# EAGLE board gcl (EAGLE 8.0.0)
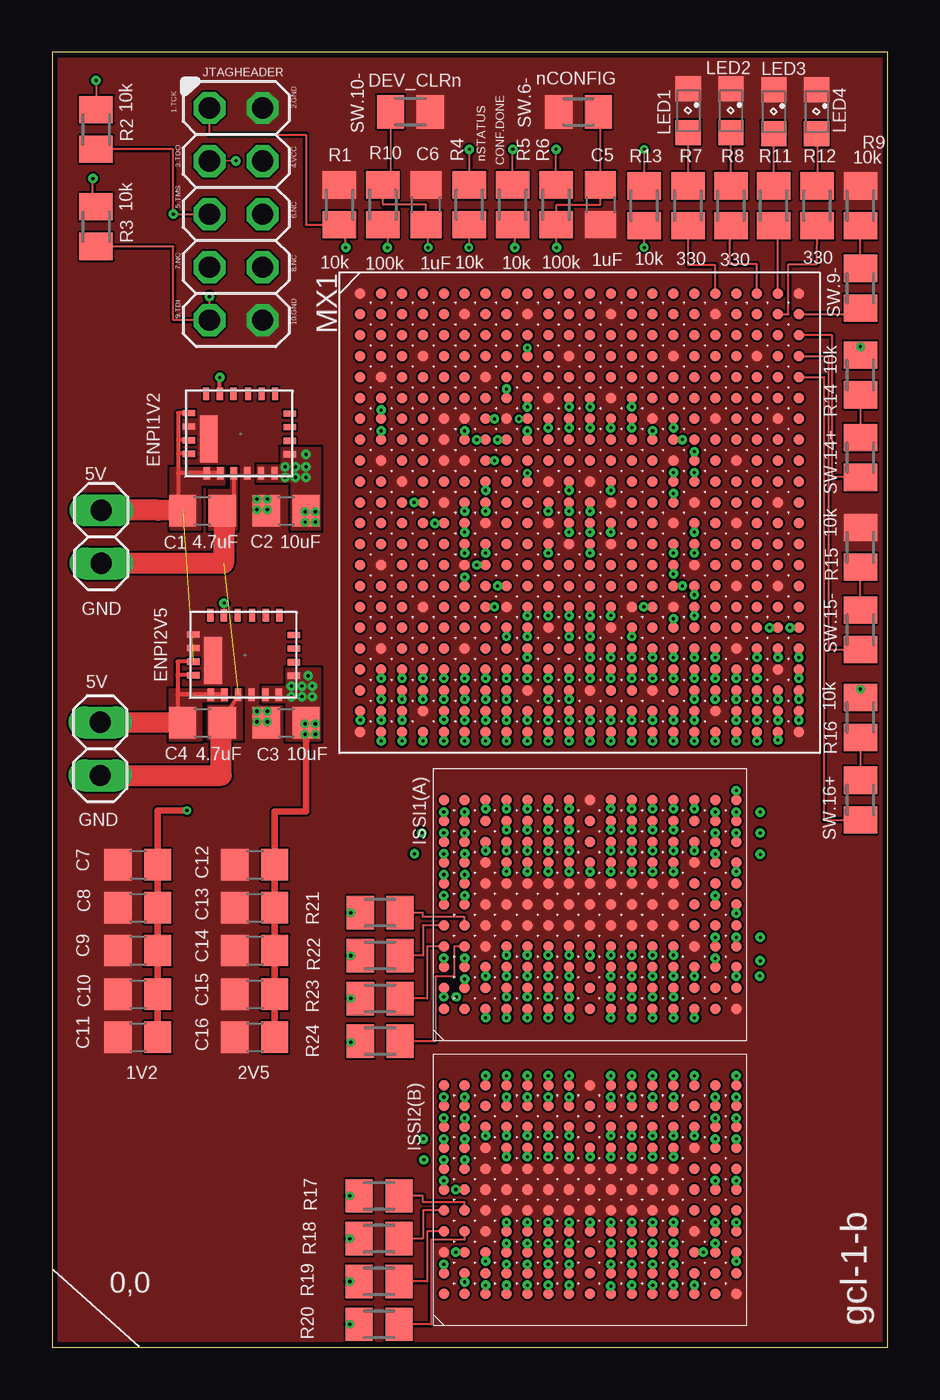
[diagram p5: board, top side]
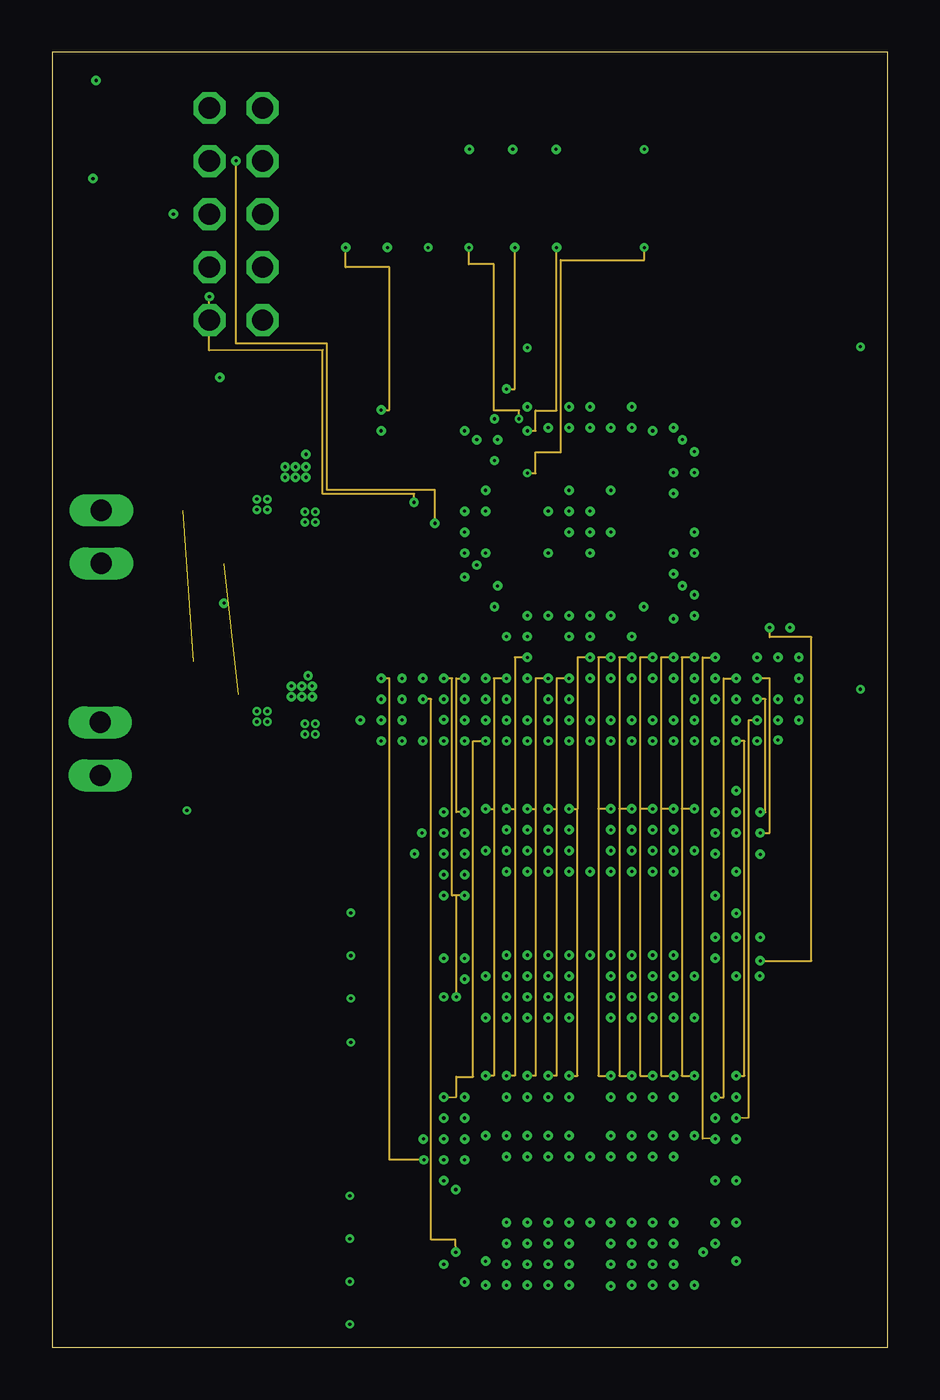
[diagram p6: board, inner layer Route2]
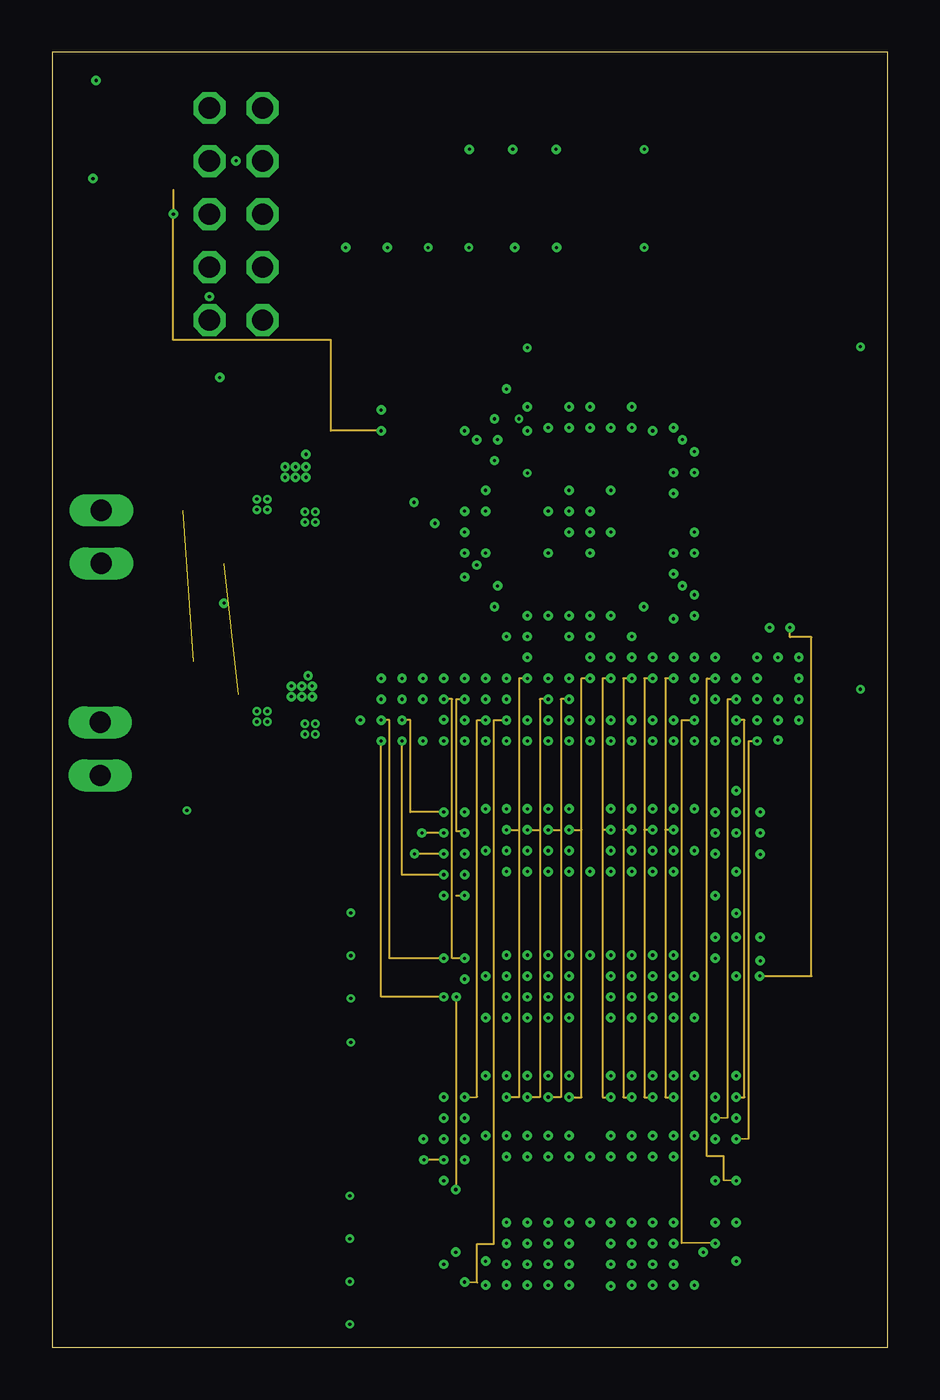
[diagram p7: board, inner layer Route3]
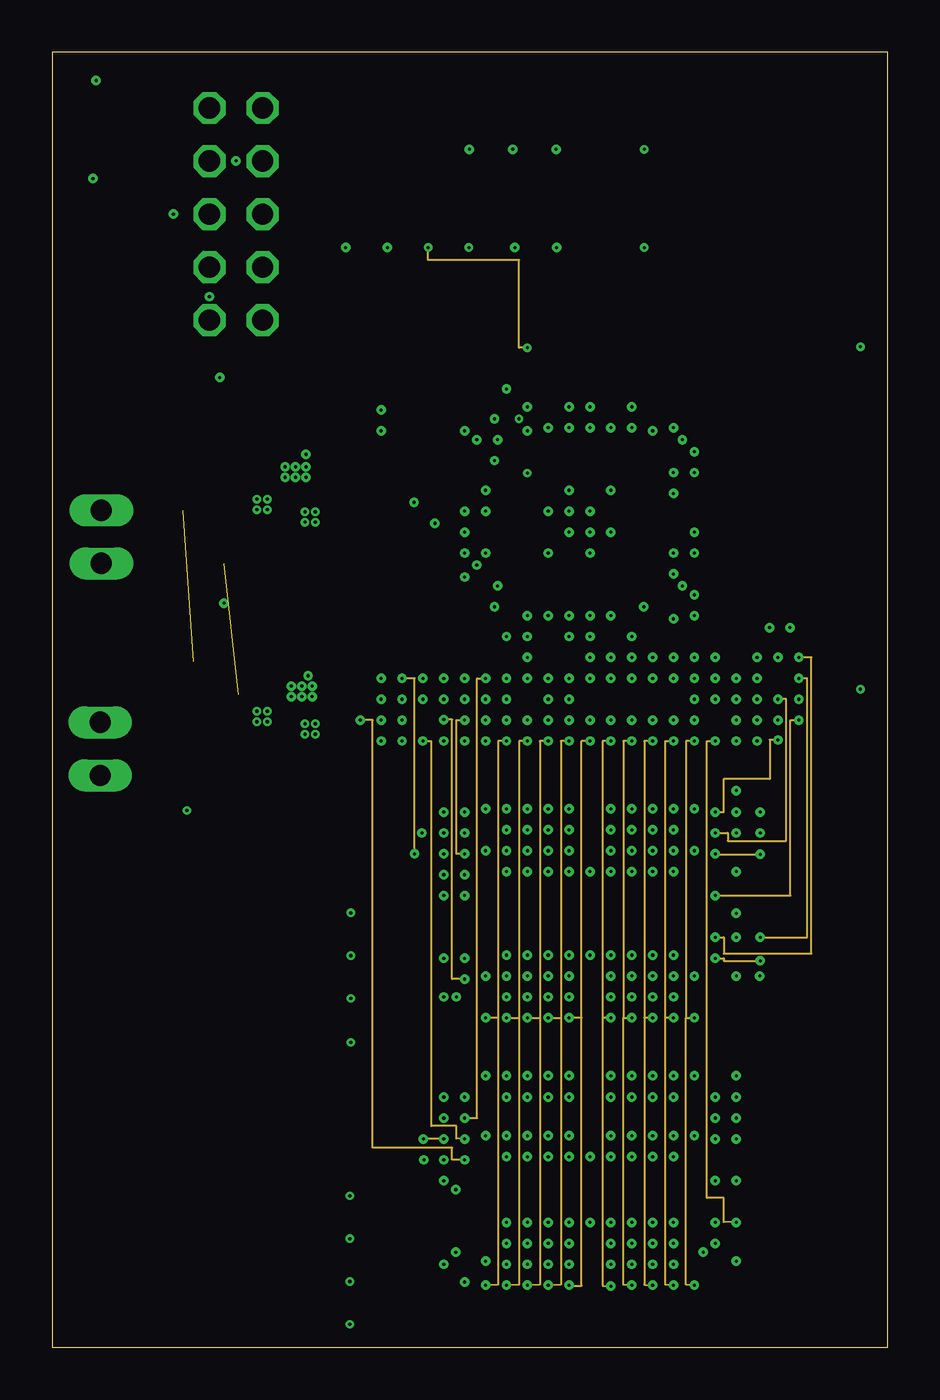
[diagram p8: board, inner layer Route14]
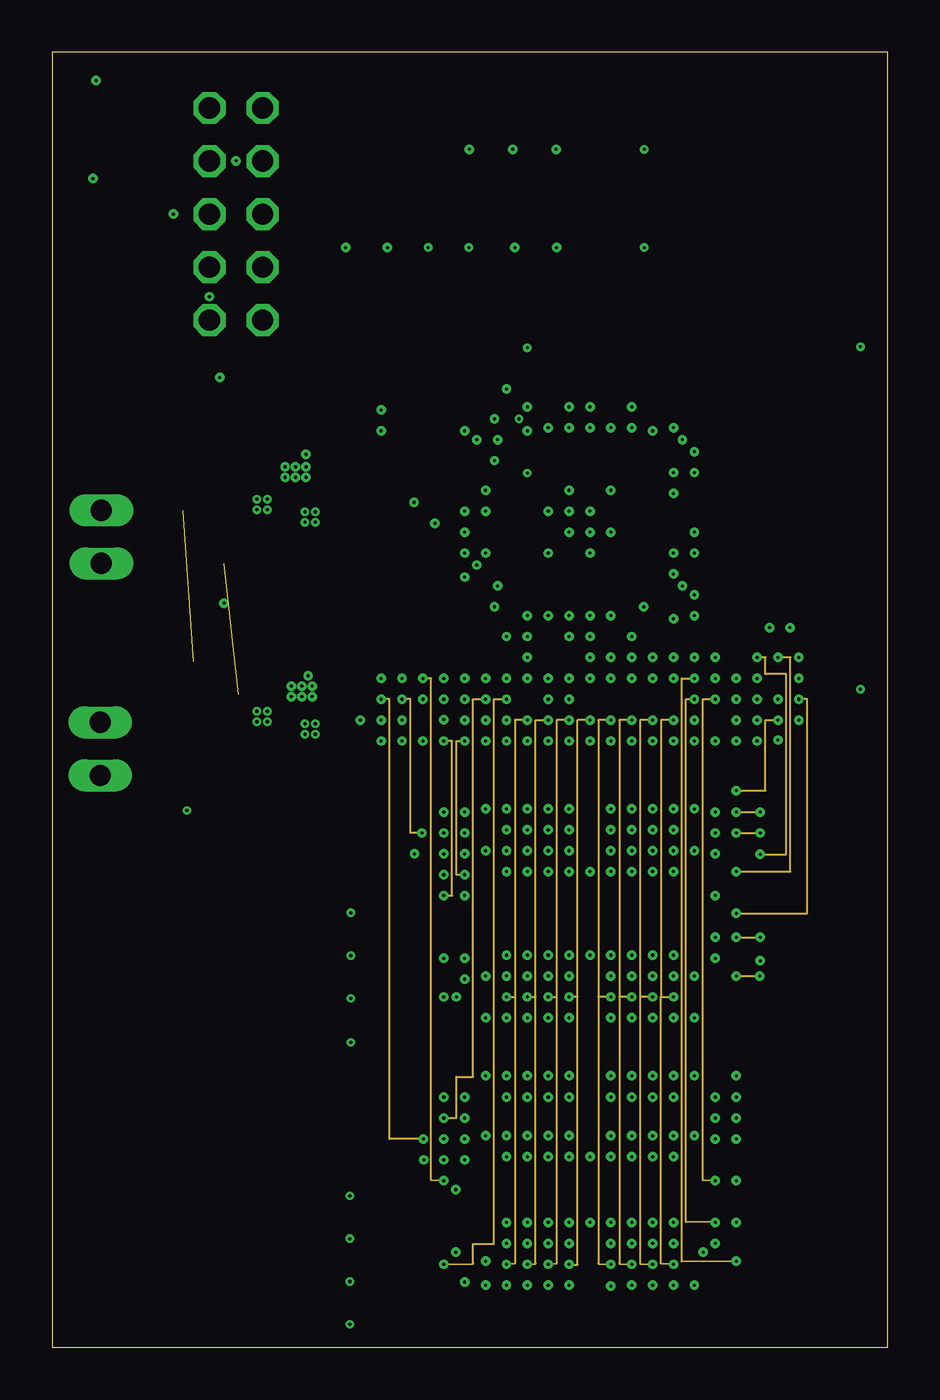
[diagram p9: board, inner layer Route15]
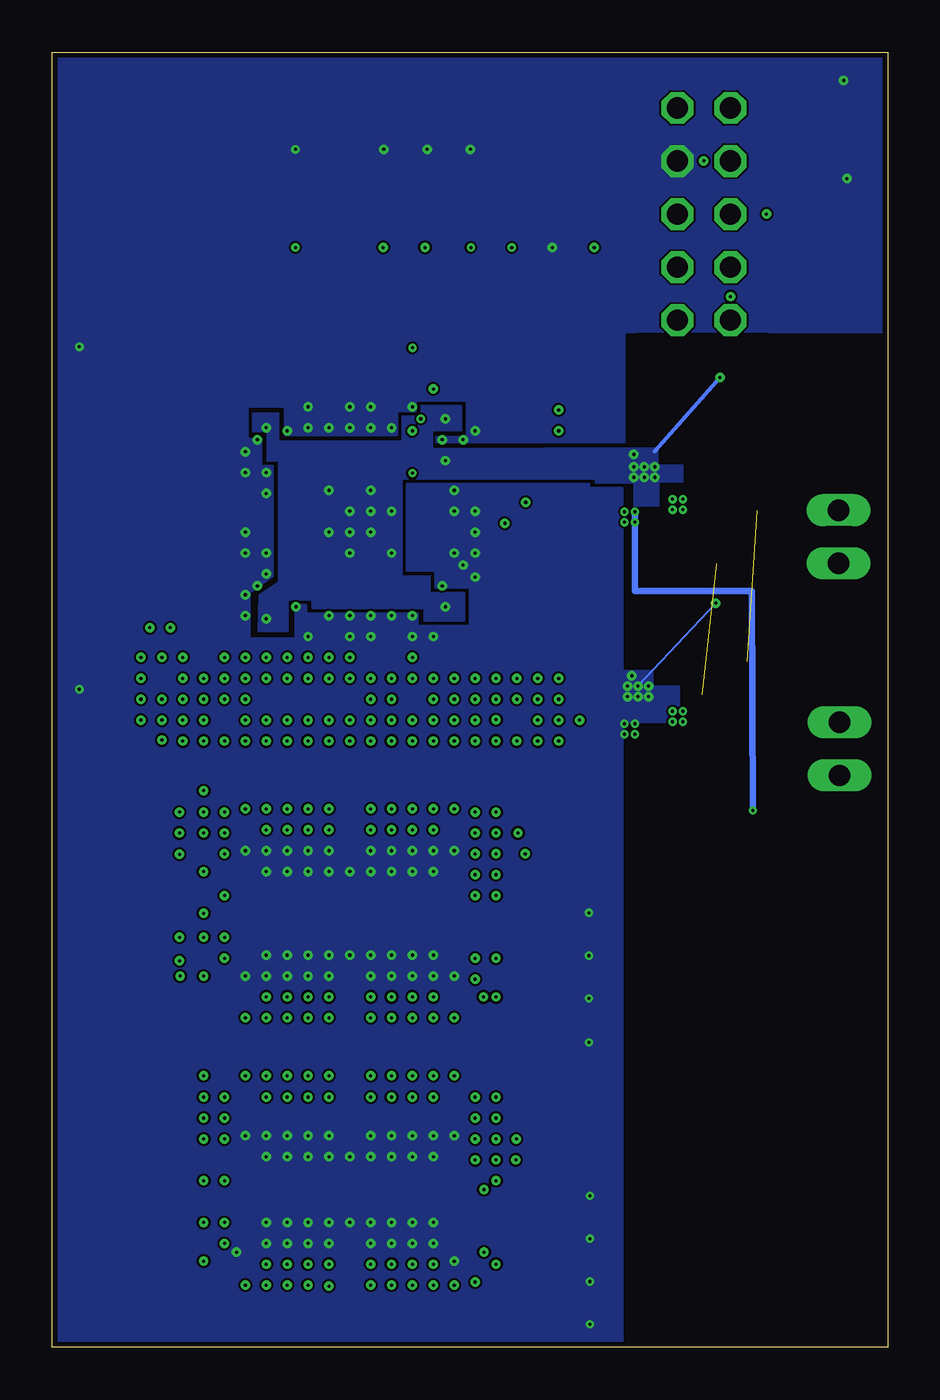
[diagram p10: board, bottom side, seen from below]

Size 40 x 62 mm. Coordinates in mm from the lower left corner, seen from the top.
Outline: 0,0 40,0 40,62 0,62 0,0
Copper layers (1+2*3+14*15+16): Top 0.012mm / dielectric 0.2mm / Route2 0.018mm / dielectric 0.36mm / Route3 0.018mm / dielectric 0.3mm / Route14 0.018mm / dielectric 0.36mm / Route15 0.018mm / dielectric 0.2mm / Bottom 0.012mm
Design rules "eC_6Layer_PClass8_BaseCopperO12-I18 *": minimum track width 0.1mm, minimum drill 0.15mm, track to track 0.1mm, track to pad 0.1mm, pad to pad 0.1mm, via to via 0.1mm, smd to smd 0mil, copper to edge 0.25mm, drill to drill 0.35mm, minimum pad ring 0.15mm, minimum via ring 0.1mm, stop-mask expansion 0mil, vias tented up to drill 0.1mm, thermal gap 0.2mm
Net classes: 1 sup: width 0.508 mm

## Footprints (pad centres in the part's own frame; a part is rotated, then mirrored left to right if it is on the bottom)
C0805 = smd 1.3 x 1.5: 1 -0.95,0; 2 0.95,0
EPAC = smd 0.3 x 0.6: 1@VIN 1.1,-4.05; 2@VIN 1.75,-4.05; 3@GND 2.4,-4.05; 4@GND 3.05,-4.05; 5@VOUT 3.7,-4.05; 6@VOUT 4.35,-4.05; 11@NC 4.375,-0.25; 12@NC 3.725,-0.25; 13@NC 3.075,-0.25; 14@NC 2.375,-0.25; 15@VSENSE 1.725,-0.25; 16@VFB 1.075,-0.25 | smd 0.6 x 0.3: 7@VOUT 5.075,-3.15; 8@NC 5.075,-2.5; 9@NC 5.075,-1.85; 10@NC 5.075,-1.2; 17@VS2 0.25,-1.175; 18@VS1 0.25,-1.825; 19@VS0 0.25,-2.475; 20@ENABLE 0.25,-3.125 | smd 0.9 x 2.25: 21@GND 1.2,-2.425
1X02 = drill 1.016 long: 1 -1.27,0; 2 1.27,0
ISSI = smd 0.5 x 0.5: A1@NC 1.55,14.55; A2@A7 2.55,14.55; A3@CEB 3.55,14.55; A4@BWCB 4.55,14.55; A5@BWBB 5.55,14.55; A6@CE2B 6.55,14.55; A7@CKEB 7.55,14.55; A8@ADV 8.55,14.55; A9@A9 9.55,14.55; A10@A11 10.55,14.55; A11@NC 11.55,14.55; B1@NC 1.55,13.55; B2@A6 2.55,13.55; B3@CE2 3.55,13.55; B4@BWDB 4.55,13.55; B5@BWAB 5.55,13.55; B6@CLK 6.55,13.55; B7@WEB 7.55,13.55; B8@OEB 8.55,13.55; B9@A8 9.55,13.55; B10@A10 10.55,13.55; B11@NC 11.55,13.55; C1@DQC0 1.55,12.55; C2@NC 2.55,12.55; C3@VDDQ 3.55,12.55; C4@GND 4.55,12.55; C5@GND 5.55,12.55; C6@GND 6.55,12.55; C7@GND 7.55,12.55; C8@GND 8.55,12.55; C9@VDDQ 9.55,12.55; C10@NC 10.55,12.55; C11@DQB0 11.55,12.55; D1@DQC1 1.55,11.55; D2@DQC3 2.55,11.55; D3@VDDQ 3.55,11.55; D4@VDD 4.55,11.55; D5@GND 5.55,11.55; D6@GND 6.55,11.55; D7@GND 7.55,11.55; D8@VDD 8.55,11.55; D9@VDDQ 9.55,11.55; D10@DQB1 10.55,11.55; D11@DQB4 11.55,11.55; E1@DQC2 1.55,10.55; E2@DQC4 2.55,10.55; E3@VDDQ 3.55,10.55; E4@VDD 4.55,10.55; E5@GND 5.55,10.55; E6@GND 6.55,10.55; E7@GND 7.55,10.55; E8@VDD 8.55,10.55; E9@VDDQ 9.55,10.55; E10@DQB2 10.55,10.55; E11@DQB5 11.55,10.55; F1@DQC5 1.55,9.55; F2@DQC7 2.55,9.55; F3@VDDQ 3.55,9.55; F4@VDD 4.55,9.55; F5@GND 5.55,9.55; F6@GND 6.55,9.55; F7@GND 7.55,9.55; F8@VDD 8.55,9.55; F9@VDDQ 9.55,9.55; F10@DQB3 10.55,9.55; F11@DQB7 11.55,9.55; G1@DQC6 1.55,8.55; G2@DQC8 2.55,8.55; G3@VDDQ 3.55,8.55; G4@VDD 4.55,8.55; G5@GND 5.55,8.55; G6@GND 6.55,8.55; G7@GND 7.55,8.55; G8@VDD 8.55,8.55; G9@VDDQ 9.55,8.55; G10@DQB6 10.55,8.55; G11@DQB8 11.55,8.55; H1@NC 1.55,7.55; H2@NC 2.55,7.55; H3@NC 3.55,7.55; H4@VDD 4.55,7.55; H5@GND 5.55,7.55; H6@GND 6.55,7.55; H7@GND 7.55,7.55; H8@VDD 8.55,7.55; H9@NC 9.55,7.55; H10@NC 10.55,7.55; H11@ZZ 11.55,7.55; J1@DQD8 1.55,6.55; J2@DQD6 2.55,6.55; J3@VDDQ 3.55,6.55; J4@VDD 4.55,6.55; J5@GND 5.55,6.55; J6@GND 6.55,6.55; J7@GND 7.55,6.55; J8@VDD 8.55,6.55; J9@VDDQ 9.55,6.55; J10@DQA8 10.55,6.55; J11@DQA6 11.55,6.55; K1@DQD7 1.55,5.55; K2@DQD3 2.55,5.55; K3@VDDQ 3.55,5.55; K4@VDD 4.55,5.55; K5@GND 5.55,5.55; K6@GND 6.55,5.55; K7@GND 7.55,5.55; K8@VDD 8.55,5.55; K9@VDDQ 9.55,5.55; K10@DQA7 10.55,5.55; K11@DQA5 11.55,5.55; L1@DQD5 1.55,4.55; L2@DQD2 2.55,4.55; L3@VDDQ 3.55,4.55; L4@VDD 4.55,4.55; L5@GND 5.55,4.55; L6@GND 6.55,4.55; L7@GND 7.55,4.55; L8@VDD 8.55,4.55; L9@VDDQ 9.55,4.55; L10@DQA4 10.55,4.55; L11@DQA2 11.55,4.55; M1@DQD4 1.55,3.55; M2@DQD1 2.55,3.55; M3@VDDQ 3.55,3.55; M4@VDD 4.55,3.55; M5@GND 5.55,3.55; M6@GND 6.55,3.55; M7@GND 7.55,3.55; M8@VDD 8.55,3.55; M9@VDDQ 9.55,3.55; M10@DQA3 10.55,3.55; M11@DQA1 11.55,3.55; N1@DQD0 1.55,2.55; N2@NC 2.55,2.55; N3@VDDQ 3.55,2.55; N4@GND 4.55,2.55; N5@NC 5.55,2.55; N6@NC 6.55,2.55; N7@NC 7.55,2.55; N8@GND 8.55,2.55; N9@VDDQ 9.55,2.55; N10@NC 10.55,2.55; N11@DQA0 11.55,2.55; P1@NC 1.55,1.55; P2@NC 2.55,1.55; P3@A5 3.55,1.55; P4@A2 4.55,1.55; P5@TDI 5.55,1.55; P6@A1 6.55,1.55; P7@TDO 7.55,1.55; P8@A18 8.55,1.55; P9@A15 9.55,1.55; P10@A14 10.55,1.55; P11@NC 11.55,1.55; R1@MODE 1.55,0.55; R2@NC 2.55,0.55; R3@A4 3.55,0.55; R4@A3 4.55,0.55; R5@TMS 5.55,0.55; R6@A0 6.55,0.55; R7@TCK 7.55,0.55; R8@A17 8.55,0.55; R9@A16 9.55,0.55; R10@A13 10.55,0.55; R11@A12 11.55,0.55
2X05 = drill 1.016 octagon: 1 -5.08,-1.27; 2 -5.08,1.27; 3 -2.54,-1.27; 4 -2.54,1.27; 5 0,-1.27; 6 0,1.27; 7 2.54,-1.27; 8 2.54,1.27; 9 5.08,-1.27; 10 5.08,1.27
SML0805 = smd 1.2 x 1.2: A 1.05,0; C -1.05,0
MXPAC = smd 0.5 x 0.5: A1@GND 2,-2; A2@IO325 3,-2; A3@IO326 4,-2; A4@IO327 5,-2; A5@IO328 6,-2; A6@IO329 7,-2; A7@IO284 8,-2; A8@IO285 9,-2; A9@IO286 10,-2; A10@IO273 11,-2; A11@IO274 12,-2; A12@IO275 13,-2; A13@IO276 14,-2; A14@IO277 15,-2; A15@IO278 16,-2; A16@IO279 17,-2; A17@IO280 18,-2; A18@IO281 19,-2; A19@IO282 20,-2; A20@IO283 21,-2; A21@IO213 22,-2; A22@GND 23,-2; AA1@IO77 2,-22; AA2@IO79 3,-22; AA3@IO80 4,-22; AA4@GND 5,-22; AA5@IO81 6,-22; AA6@IO82 7,-22; AA7@IO83 8,-22; AA8@IO84 9,-22; AA9@IO85 10,-22; AA10@IO78 11,-22; AA11@IO125 12,-22; AA12@IO126 13,-22; AA13@IO127 14,-22; AA14@IO128 15,-22; AA15@IO129 16,-22; AA16@IO130 17,-22; AA17@IO131 18,-22; AA18@GND 19,-22; AA19@IO132 20,-22; AA20@IO133 21,-22; AA21@IO173 22,-22; AA22@IO174 23,-22; AB1@GND 2,-23; AB2@IO86 3,-23; AB3@IO87 4,-23; AB4@IO88 5,-23; AB5@IO89 6,-23; AB6@IO90 7,-23; AB7@IO91 8,-23; AB8@IO92 9,-23; AB9@IO93 10,-23; AB10@IO134 11,-23; AB11@IO135 12,-23; AB12@IO136 13,-23; AB13@IO137 14,-23; AB14@IO138 15,-23; AB15@IO139 16,-23; AB16@IO140 17,-23; AB17@IO141 18,-23; AB18@IO142 19,-23; AB19@IO143 20,-23; AB20@IO144 21,-23; AB21@IO145 22,-23; AB22@GND 23,-23; B1@IO330 2,-3; B2@IO331 3,-3; B3@IO332 4,-3; B4@IO333 5,-3; B5@IO334 6,-3; B6@GND 7,-3; B7@IO335 8,-3; B8@IO295 9,-3; B9@GND 10,-3; B10@IO287 11,-3; B11@IO288 12,-3; B12@IO289 13,-3; B13@GND 14,-3; B14@IO290 15,-3; B15@IO291 16,-3; B16@IO292 17,-3; B17@IO293 18,-3; B18@GND 19,-3; B19@IO294 20,-3; B20@IO214 21,-3; B21@IO215 22,-3; B22@IO216 23,-3; C1@IO17 2,-4; C2@IO336 3,-4; C3@IO337 4,-4; C4@IO338 5,-4; C5@IO339 6,-4; C6@IO340 7,-4; C7@IO341 8,-4; C8@IO342 9,-4; C9@IO306 10,-4; C10@IO296 11,-4; C11@IO297 12,-4; C12@IO298 13,-4; C13@IO299 14,-4; C14@IO300 15,-4; C15@IO301 16,-4; C16@IO302 17,-4; C17@IO303 18,-4; C18@IO304 19,-4; C19@IO305 20,-4; C20@IO217 21,-4; C21@IO218 22,-4; C22@IO219 23,-4; D1@IO18 2,-5; D2@IO19 3,-5; D3@IO20 4,-5; D4@GND 5,-5; D5@IO344 6,-5; D6@IO345 7,-5; D7@IO346 8,-5; D8@IO347 9,-5; D9@IO348 10,-5; D10@IO343 11,-5; D11@GND 12,-5; D12@IO307 13,-5; D13@IO308 14,-5; D14@IO309 15,-5; D15@IO310 16,-5; D16@GND 17,-5; D17@IO311 18,-5; D18@IO220 19,-5; D19@IO221 20,-5; D20@GND 21,-5; D21@IO222 22,-5; D22@IO223 23,-5; E1@IO21 2,-6; E2@GND 3,-6; E3@IO1 4,-6; E4@IO2 5,-6; E5@NC 6,-6; E6@IO351 7,-6; E7@GND 8,-6; E8@IO352 9,-6; E9@IO353 10,-6; E10@IO349 11,-6; E11@IO350 12,-6; E12@IO312 13,-6; E13@IO313 14,-6; E14@IO314 15,-6; E15@IO315 16,-6; E16@IO316 17,-6; E17@IO224 18,-6; E18@IO225 19,-6; E19@IO226 20,-6; E20@IO227 21,-6; E21@IO228 22,-6; E22@IO229 23,-6; F1@IO22 2,-7; F2@IO23 3,-7; F3@IO3 4,-7; F4@IO4 5,-7; F5@IO5 6,-7; F6@NC 7,-7; F7@IO354 8,-7; F8@IO355 9,-7; F9@VCCIO8 10,-7; F10@GND 11,-7; F11@VCCIO8 12,-7; F12@VCCIO7 13,-7; F13@GND 14,-7; F14@VCCIO7 15,-7; F15@IO317 16,-7; F16@IO318 17,-7; F17@IO230 18,-7; F18@IO231 19,-7; F19@IO232 20,-7; F20@IO233 21,-7; F21@IO234 22,-7; F22@IO235 23,-7; G1@IO24 2,-8; G2@IO25 3,-8; G3@IO6 4,-8; G4@IO7 5,-8; G5@GND 6,-8; G6@GND 7,-8; G7@VCCD_PLL3 8,-8; G8@GND 9,-8; G9@IO356 10,-8; G10@VCCIO8 11,-8; G11@VCCIO8 12,-8; G12@VCCIO7 13,-8; G13@VCCIO7 14,-8; G14@VCCIO7 15,-8; G15@GND 16,-8; G16@VCCD_PLL2 17,-8; G17@IO236 18,-8; G18@GND 19,-8; G19@IO237 20,-8; G20@IO238 21,-8; G21@GND 22,-8; G22@IO239 23,-8; H1@IO26 2,-9; H2@IO27 3,-9; H3@IO8 4,-9; H4@IO9 5,-9; H5@GND 6,-9; H6@VCCA3 7,-9; H7@VCCA3 8,-9; H8@VCCA3 9,-9; H9@IO359 10,-9; H10@IO357 11,-9; H11@IO358 12,-9; H12@IO319 13,-9; H13@IO320 14,-9; H14@IO321 15,-9; H15@VCCA2 16,-9; H16@VCCIO6 17,-9; H17@IO240 18,-9; H18@IO241 19,-9; H19@IO242 20,-9; H20@IO243 21,-9; H21@IO244 22,-9; H22@IO245 23,-9; J1@IO28 2,-10; J2@GND 3,-10; J3@IO10 4,-10; J4@IO11 5,-10; J5@GND 6,-10; J6@GND 7,-10; J7@VCC 8,-10; J8@IO12 9,-10; J9@IO13 10,-10; J10@IO360 11,-10; J11@IO322 12,-10; J12@IO323 13,-10; J13@IO324 14,-10; J14@IO246 15,-10; J15@IO247 16,-10; J16@GND 17,-10; J17@VCCIO6 18,-10; J18@IO248 19,-10; J19@GND 20,-10; J20@IO249 21,-10; J21@IO250 22,-10; J22@IO251 23,-10; K1@IO29 2,-11; K2@IO30 3,-11; K3@GND 4,-11; K4@IO14 5,-11; K5@IO15 6,-11; K6@IO16 7,-11; K7@VCCIO1A 8,-11; K8@IO31 9,-11; K9@IO32 10,-11; K10@GND 11,-11; K11@VCC 12,-11; K12@GND 13,-11; K13@VCC 14,-11; K14@IO252 15,-11; K15@IO253 16,-11; K16@VCCIO6 17,-11; K17@VCCIO6 18,-11; K18@IO254 19,-11; K19@IO255 20,-11; K20@IO256 21,-11; K21@IO257 22,-11; K22@IO258 23,-11; L1@IO33 2,-12; L2@IO34 3,-12; L3@DNU 4,-12; L4@IO35 5,-12; L5@GND 6,-12; L6@VCCIO1A 7,-12; L7@VCCIO1B 8,-12; L8@IO36 9,-12; L9@IO37 10,-12; L10@VCC 11,-12; L11@VCC 12,-12; L12@VCC 13,-12; L13@GND 14,-12; L14@IO259 15,-12; L15@IO260 16,-12; L16@VCCIO6 17,-12; L17@GND 18,-12; L18@IO261 19,-12; L19@IO262 20,-12; L20@IO263 21,-12; L21@GND 22,-12; L22@IO175 23,-12; M1@IO41 2,-13; M2@IO42 3,-13; M3@IO38 4,-13; M4@IO39 5,-13; M5@IO40 6,-13; M6@VCCIO1B 7,-13; M7@GND 8,-13; M8@IO43 9,-13; M9@IO44 10,-13; M10@GND 11,-13; M11@VCC 12,-13; M12@VCC 13,-13; M13@VCC 14,-13; M14@IO264 15,-13; M15@IO265 16,-13; M16@GND 17,-13; M17@VCCIO6 18,-13; M18@IO266 19,-13; M19@GND 20,-13; M20@IO267 21,-13; M21@IO176 22,-13; M22@IO177 23,-13; N1@IO45 2,-14; N2@IO46 3,-14; N3@IO47 4,-14; N4@IO48 5,-14; N5@IO49 6,-14; N6@VCCIO2 7,-14; N7@VCCIO2 8,-14; N8@IO50 9,-14; N9@IO51 10,-14; N10@VCC 11,-14; N11@GND 12,-14; N12@VCC 13,-14; N13@GND 14,-14; N14@IO268 15,-14; N15@IO269 16,-14; N16@VCCIO5 17,-14; N17@VCCIO6 18,-14; N18@IO270 19,-14; N19@IO271 20,-14; N20@IO272 21,-14; N21@IO178 22,-14; N22@IO179 23,-14; P1@IO52 2,-15; P2@GND 3,-15; P3@IO53 4,-15; P4@IO54 5,-15; P5@IO55 6,-15; P6@GND 7,-15; P7@VCCIO2 8,-15; P8@IO56 9,-15; P9@IO96 10,-15; P10@IO94 11,-15; P11@IO95 12,-15; P12@IO146 13,-15; P13@IO147 14,-15; P14@IO180 15,-15; P15@IO181 16,-15; P16@VCCIO5 17,-15; P17@GND 18,-15; P18@IO182 19,-15; P19@IO183 20,-15; P20@IO184 21,-15; P21@IO185 22,-15; P22@IO186 23,-15; R1@IO57 2,-16; R2@IO58 3,-16; R3@IO59 4,-16; R4@IO60 5,-16; R5@IO61 6,-16; R6@VCCIO2 7,-16; R7@IO62 8,-16; R8@VCCA1 9,-16; R9@IO99 10,-16; R10@IO97 11,-16; R11@IO98 12,-16; R12@IO148 13,-16; R13@IO149 14,-16; R14@IO187 15,-16; R15@IO188 16,-16; R16@VCCIO5 17,-16; R17@VCCIO5 18,-16; R18@IO189 19,-16; R19@GND 20,-16; R20@IO190 21,-16; R21@GND 22,-16; R22@IO191 23,-16; T1@IO63 2,-17; T2@IO64 3,-17; T3@IO65 4,-17; T4@GND 5,-17; T5@IO66 6,-17; T6@IO67 7,-17; T7@VCCD_PLL1 8,-17; T8@GND 9,-17; T9@VCCIO3 10,-17; T10@VCCIO3 11,-17; T11@VCCIO3 12,-17; T12@VCCIO4 13,-17; T13@VCCIO4 14,-17; T14@GND 15,-17; T15@VCCA4 16,-17; T16@GND 17,-17; T17@VCCIO5 18,-17; T18@IO192 19,-17; T19@IO193 20,-17; T20@IO194 21,-17; T21@IO195 22,-17; T22@IO196 23,-17; U1@IO68 2,-18; U2@IO69 3,-18; U3@IO70 4,-18; U4@IO71 5,-18; U5@IO72 6,-18; U6@IO100 7,-18; U7@IO101 8,-18; U8@VCCIO3 9,-18; U9@VCCIO3 10,-18; U10@GND 11,-18; U11@VCCIO4 12,-18; U12@VCCIO4 13,-18; U13@GND 14,-18; U14@VCCIO4 15,-18; U15@IO150 16,-18; U16@VCCD_PLL4 17,-18; U17@IO197 18,-18; U18@IO198 19,-18; U19@IO199 20,-18; U20@IO200 21,-18; U21@IO201 22,-18; U22@IO202 23,-18; V1@IO73 2,-19; V2@GND 3,-19; V3@IO74 4,-19; V4@IO103 5,-19; V5@IO104 6,-19; V6@GND 7,-19; V7@IO105 8,-19; V8@IO106 9,-19; V9@IO107 10,-19; V10@IO102 11,-19; V11@IO151 12,-19; V12@IO152 13,-19; V13@IO153 14,-19; V14@IO154 15,-19; V15@IO155 16,-19; V16@IO156 17,-19; V17@IO157 18,-19; V18@IO203 19,-19; V19@GND 20,-19; V20@IO204 21,-19; V21@IO205 22,-19; V22@IO206 23,-19; W1@IO75 2,-20; W2@IO76 3,-20; W3@IO109 4,-20; W4@IO110 5,-20; W5@IO111 6,-20; W6@IO112 7,-20; W7@IO113 8,-20; W8@IO114 9,-20; W9@IO115 10,-20; W10@IO108 11,-20; W11@IO158 12,-20; W12@IO159 13,-20; W13@IO160 14,-20; W14@IO161 15,-20; W15@IO162 16,-20; W16@IO163 17,-20; W17@IO164 18,-20; W18@IO165 19,-20; W19@IO207 20,-20; W20@IO208 21,-20; W21@GND 22,-20; W22@IO209 23,-20; Y1@IO116 2,-21; Y2@IO118 3,-21; Y3@IO119 4,-21; Y4@IO120 5,-21; Y5@IO121 6,-21; Y6@IO122 7,-21; Y7@IO123 8,-21; Y8@IO124 9,-21; Y9@GND 10,-21; Y10@IO117 11,-21; Y11@IO166 12,-21; Y12@GND 13,-21; Y13@IO167 14,-21; Y14@IO168 15,-21; Y15@GND 16,-21; Y16@IO169 17,-21; Y17@IO170 18,-21; Y18@IO171 19,-21; Y19@IO172 20,-21; Y20@IO210 21,-21; Y21@IO211 22,-21; Y22@IO212 23,-21
M0805 = smd 1.3 x 1.6: 1 -0.95,0; 2 0.95,0

## Placement (x,y rotation side)
C1  [C0805]  7.2,40.05 0 top
C2  [C0805]  11.2,40.05 0 top
C3  [C0805]  11.2,29.9 0 top
C4  [C0805]  7.2,29.9 0 top
C5  1uF  [C0805]  26.25,54.7 270 top
C6  1uF  [C0805]  17.9,54.7 90 top
C7  [C0805]  4.1,23.1 0 top
C8  [C0805]  4.1,21.05 0 top
C9  [C0805]  4.1,19 0 top
C10  [C0805]  4.1,16.9 0 top
C11  [C0805]  4.1,14.85 0 top
C12  [C0805]  9.7,23.1 0 top
C13  [C0805]  9.7,21.05 0 top
C14  [C0805]  9.7,19 0 top
C15  [C0805]  9.7,16.9 0 top
C16  [C0805]  9.7,14.85 0 top
ENPI1V2  ENPIRIONEVAR1  [EPAC]  6.3,45.9 0 top
ENPI2V5  ENPIRIONEVAR1  [EPAC]  6.5,35.3 0 top
INPOW  [1X02]  2.35,38.8 270 top
INPOW2  [1X02]  2.3,28.65 270 top
ISSI1(A)  [ISSI]  33.3,14.65 90 top
ISSI2(B)  [ISSI]  33.3,1 90 top
JTAGHEADER  [2X05]  8.8,54.25 270 top
LED1  [SML0805]  30.45,59.2 270 top
LED2  [SML0805]  32.5,59.2 270 top
LED3  [SML0805]  34.55,59.15 270 top
LED4  [SML0805]  36.6,59.15 270 top
MX1  [MXPAC]  12.75,52.45 0 top
R1  10k  [M0805]  13.75,54.7 90 top
R2  10k  [M0805]  2.1,58.3 90 top
R3  10k  [M0805]  2.1,53.65 90 top
R4  10k  [M0805]  19.97,54.7 270 top
R5  10k  [M0805]  22.05,54.7 270 top
R6  100k  [M0805]  24.12,54.7 270 top
R7  330  [M0805]  30.45,54.65 270 top
R8  330  [M0805]  32.5,54.65 270 top
R9  10k  [M0805]  38.7,54.65 270 top
R10  100k  [M0805]  15.82,54.7 90 top
R11  330  [M0805]  34.55,54.65 270 top
R12  330  [M0805]  36.62,54.65 270 top
R13  10k  [M0805]  28.35,54.65 270 top
R14  10k  [M0805]  38.7,46.55 270 top
R15  10k  [M0805]  38.7,38.3 270 top
R16  10k  [M0805]  38.7,30.15 270 top
R17  10k  [M0805]  15.65,7.25 0 top
R18  10k  [M0805]  15.65,5.2 0 top
R19  10k  [M0805]  15.65,3.15 0 top
R20  10k  [M0805]  15.65,1.1 0 top
R21  10k  [M0805]  15.7,20.8 0 top
R22  10k  [M0805]  15.7,18.75 0 top
R23  10k  [M0805]  15.7,16.7 0 top
R24  10k  [M0805]  15.7,14.65 0 top
SW.6-  0  [M0805]  25.2,59.15 180 top
SW.9-  0  [M0805]  38.7,50.7 270 top
SW.10-  0  [M0805]  17.15,59.15 0 top
SW.14+  0  [M0805]  38.7,42.6 270 top
SW.15-  0  [M0805]  38.7,34.35 270 top
SW.16+  0  [M0805]  38.7,26.2 270 top

## Tracks (layer width: path | path; a pad name or v marks a point on that pad's centre or on a via)
1V2  (via drill 0.15 pad 0.4, 0.15 pad 0.45)
  Top 0.1: MX1.L11@VCC v24.75,40.02 | MX1.L10@VCC v23.75,40.02 | MX1.M11@VCC v24.75,39.02 | MX1.M12@VCC v25.75,39.02 | MX1.N12@VCC v25.75,38.02 | MX1.N10@VCC v23.75,38.02 | MX1.M13@VCC v26.75,39.02 | MX1.L12@VCC v25.75,40.02 | MX1.K11@VCC v24.75,41.02 | MX1.K13@VCC v26.75,41.02 | MX1.G16@VCCD_PLL2 v29.75,44.02 | MX1.U16@VCCD_PLL4 v29.75,34.88 | MX1.G7@VCCD_PLL3 v21.18,44.45 | MX1.T7@VCCD_PLL1 v21.18,35.45 | MX1.J7@VCC v21.18,42.45
  Top 0.2: ENPI1V2.15@VSENSE v8.02,46.42
  Top 0.305: C11.2 C10.2 C9.2 C8.2 C7.2 5.05,25.7 v6.45,25.7
  Bottom 0.1: v24.75,40.02 24.7,40 | v23.75,40.02 23.75,39.95 | v25.75,38.02 25.75,37.95 | v23.75,38.02 23.75,37.95 | v26.75,39.02 26.75,38.95 | v25.75,40.02 25.75,39.95 | v24.75,41.02 24.75,40.95 | v26.75,41.02 26.75,40.95 | v29.75,44.02 29.75,43.95 | v29.75,34.88 29.75,34.95 | v21.18,42.45 21.25,42.45
  Bottom 0.2: v8.02,46.42 11.15,42.9
  Bottom 0.305: v6.45,25.7 6.5,36.2 12.1,36.2 v12.1,40
  other vias: 12.15,42.15 12.15,42.75 12.15,41.65 11.65,42.15 11.65,41.65 11.15,41.65 11.15,42.15 12.6,40 12.1,39.5 12.6,39.5
  pour Bottom (no thermals): 11,43.05 21.8,43 21.8,43.9 20.4,43.9 20.4,45.05 22.35,45.05 22.35,44.55 23.25,44.55 23.25,43.35 29.15,43.35 29.15,44.7 30.4,44.7 30.4,43.85 29.7,43.85 29.7,42.45 29.15,42.45 29.15,36.6 30.1,36 30.15,34.3 28.7,34.3 28.7,35.8 27.55,35.8 27.55,35.4 22.2,35.4 22.2,34.8 20.25,34.8 20.25,36.1 21.9,36.1 21.9,36.9 23.25,36.9 23.25,41.6 14,41.6 14,41.4 12.15,41.4 12.15,40.3 10.95,40.3 10.95,41.45 9.8,41.45 9.8,42.2 11,42.2
  pour Top (no thermals): 12.85,39.15 12.85,43.05 10.95,43.05 10.95,42.2 9.8,42.2 9.8,41.45 11.45,41.45 11.45,39.15
2V5  (via drill 0.15 pad 0.4, 0.15 pad 0.45)
  Top 0.1: MX1.F9@VCCIO8 v22.75,45.02 | MX1.G10@VCCIO8 v23.75,44.02 | MX1.G11@VCCIO8 v24.75,44.02 | MX1.F11@VCCIO8 v24.75,45.02 | MX1.F12@VCCIO7 v25.75,45.02 | MX1.G12@VCCIO7 v25.75,44.02 | MX1.G13@VCCIO7 v26.75,44.02 | MX1.G14@VCCIO7 v27.75,44.02 | MX1.F14@VCCIO7 v27.75,45.02 | MX1.H15@VCCA2 v28.75,43.88 | MX1.H16@VCCIO6 v30.18,43.45 | MX1.K16@VCCIO6 v29.75,41.88 | MX1.K17@VCCIO6 v30.75,41.88 | MX1.J17@VCCIO6 v30.75,42.88 | MX1.M17@VCCIO6 v30.75,39.02 | MX1.N17@VCCIO6 v30.75,38.02 | MX1.N16@VCCIO5 v29.75,38.02 | MX1.L16@VCCIO6 v29.75,40.88 | MX1.P16@VCCIO5 v29.75,37.02 | MX1.R16@VCCIO5 v30.18,36.45 | MX1.R17@VCCIO5 v30.75,36.02 | MX1.T17@VCCIO5 v30.75,35.02 | MX1.T15@VCCA4 v28.32,35.45 | MX1.U14@VCCIO4 v27.75,34.02 | MX1.T13@VCCIO4 v26.75,35.02 | MX1.T12@VCCIO4 v25.75,35.02 | MX1.U12@VCCIO4 v25.75,34.02 | MX1.U11@VCCIO4 v24.75,34.02 | MX1.T11@VCCIO3 v24.75,35.02 | MX1.T10@VCCIO3 v23.75,35.02 | MX1.T9@VCCIO3 v22.75,35.02 | MX1.U9@VCCIO3 v22.75,34.02 | MX1.U8@VCCIO3 v21.75,34.02 | MX1.R8@VCCA1 v21.32,36.45 | MX1.R6@VCCIO2 v19.75,36.88 | MX1.P7@VCCIO2 v20.32,37.45 | MX1.N7@VCCIO2 v20.75,38.02 | MX1.N6@VCCIO2 v19.75,38.02 | MX1.M6@VCCIO1B v19.75,39.02 | MX1.L6@VCCIO1A v19.75,40.02 | MX1.L7@VCCIO1B v20.75,40.02 | MX1.K7@VCCIO1A v20.75,41.02 | MX1.H6@VCCA3 v19.75,43.88 | MX1.H7@VCCA3 v20.32,43.45 | MX1.H8@VCCA3 v21.32,43.45 | ISSI1(A).C9@VDDQ v20.75,23.77 | ISSI1(A).D9@VDDQ v21.75,23.77 | ISSI1(A).E9@VDDQ v22.75,23.77 | ISSI1(A).D8@VDD v21.75,22.77 | ISSI1(A).E8@VDD v22.75,22.77 | ISSI1(A).F8@VDD v23.75,22.77 | ISSI1(A).G8@VDD v24.75,22.77 | ISSI1(A).F9@VDDQ v23.75,23.77 | ISSI1(A).G9@VDDQ v24.75,23.77 | ISSI1(A).H8@VDD v25.75,22.77 | ISSI1(A).J8@VDD v26.75,22.77
  Top 0.1: ISSI1(A).K8@VDD v27.75,22.77 | ISSI1(A).L8@VDD v28.75,22.77 | ISSI1(A).J9@VDDQ v26.75,23.77 | ISSI1(A).K9@VDDQ v27.75,23.77 | ISSI1(A).L9@VDDQ v28.75,23.77 | ISSI1(A).M9@VDDQ v29.75,23.77 | ISSI1(A).N9@VDDQ v30.75,23.77 | ISSI1(A).M8@VDD v29.75,22.77 | ISSI1(A).C3@VDDQ v20.75,17.77 | ISSI1(A).D3@VDDQ v21.75,17.77 | ISSI1(A).D4@VDD v21.75,18.77 | ISSI1(A).E4@VDD v22.75,18.77 | ISSI1(A).F4@VDD v23.75,18.77 | ISSI1(A).G4@VDD v24.75,18.77 | ISSI1(A).H4@VDD v25.75,18.77 | ISSI1(A).F3@VDDQ v23.75,17.77 | ISSI1(A).E3@VDDQ v22.75,17.77 | ISSI1(A).G3@VDDQ v24.75,17.77 | ISSI1(A).J4@VDD v26.75,18.77 | ISSI1(A).K4@VDD v27.75,18.77 | ISSI1(A).L4@VDD v28.75,18.77 | ISSI1(A).M4@VDD v29.75,18.77 | ISSI1(A).J3@VDDQ v26.75,17.77 | ISSI1(A).K3@VDDQ v27.75,17.77 | ISSI1(A).L3@VDDQ v28.75,17.77 | ISSI1(A).M3@VDDQ v29.75,17.77 | ISSI1(A).N3@VDDQ v30.75,17.77 | ISSI2(B).C9@VDDQ v20.75,10.12 | ISSI2(B).D9@VDDQ v21.75,10.12 | ISSI2(B).D8@VDD v21.75,9.12 | ISSI2(B).E9@VDDQ v22.75,10.12 | ISSI2(B).F9@VDDQ v23.75,10.12 | ISSI2(B).G9@VDDQ v24.75,10.12 | ISSI2(B).F8@VDD v23.75,9.12 | ISSI2(B).G8@VDD v24.75,9.12 | ISSI2(B).E8@VDD v22.75,9.12 | ISSI2(B).H8@VDD v25.75,9.12 | ISSI2(B).J8@VDD v26.75,9.12 | ISSI2(B).J9@VDDQ v26.75,10.12 | ISSI2(B).K9@VDDQ v27.75,10.12 | ISSI2(B).L9@VDDQ v28.75,10.12 | ISSI2(B).M9@VDDQ v29.75,10.12 | ISSI2(B).N9@VDDQ v30.75,10.12 | ISSI2(B).M8@VDD v29.75,9.12 | ISSI2(B).L8@VDD v28.75,9.12 | ISSI2(B).K8@VDD v27.75,9.12 | ISSI2(B).C3@VDDQ v20.75,4.12 | ISSI2(B).D3@VDDQ v21.75,4.97 | ISSI2(B).D4@VDD v21.75,5.97 | ISSI2(B).E4@VDD v22.75,5.97 | ISSI2(B).F4@VDD v23.75,5.97 | ISSI2(B).G4@VDD v24.75,5.97 | ISSI2(B).G3@VDDQ v24.75,4.97 | ISSI2(B).F3@VDDQ v23.75,4.97
  Top 0.1: ISSI2(B).E3@VDDQ v22.75,4.97 | ISSI2(B).H4@VDD v25.75,5.97 | ISSI2(B).J4@VDD v26.75,5.97 | ISSI2(B).J3@VDDQ v26.75,4.97 | ISSI2(B).K3@VDDQ v27.75,4.97 | ISSI2(B).K4@VDD v27.75,5.97 | ISSI2(B).L3@VDDQ v28.75,4.97 | ISSI2(B).L4@VDD v28.75,5.97 | ISSI2(B).M4@VDD v29.75,5.97 | ISSI2(B).M3@VDDQ v29.75,4.97 | ISSI2(B).N3@VDDQ v31.18,4.55 | ENPI2V5.15@VSENSE v8.22,35.62 | v2.1,60.65 R2.2 | v1.95,55.95 1.95,54.9 R3.2 | R6.1 v24.12,57.35 | R5.1 v22.05,57.35 | R4.1 v19.97,57.35 | R10.1 16.05,53.25 v16.05,52.65 | R13.1 v28.35,57.35 | R14.1 v38.7,47.9 | R16.1 v38.7,31.5 | R24.1 v14.3,14.6 | v14.3,16.7 R23.1 | R17.1 v14.25,7.25 | R19.1 v14.25,3.15 | R18.1 v14.25,5.2 | R20.1 v14.25,1.1 | R22.1 v14.3,18.75 | R21.1 v14.3,20.8
  Top 0.305: C16.2 C15.2 C14.2 C13.2 C12.2 10.65,25.65 12.15,25.65 C3.2
  Bottom 0.1: v22.75,45.02 22.75,44.9 | v23.75,44.02 23.75,43.95 | v24.75,44.02 24.75,43.95 | v24.75,45.02 24.75,44.95 | v25.75,45.02 25.75,44.95 | v25.75,44.02 25.75,43.95 | v26.75,44.02 26.75,43.95 | v27.75,44.02 27.75,43.95 | v27.75,45.02 27.75,44.9 | v28.75,43.88 28.75,43.92 | v30.18,43.45 30.25,43.45 | v29.75,41.88 29.75,41.95 | v30.75,41.88 30.75,42 | v30.75,42.88 30.75,42.95 | v30.75,39.02 30.75,38.95 | v30.75,38.02 30.75,37.95 | v29.75,38.02 29.75,37.95 | v29.75,40.88 29.75,40.95 | v29.75,37.02 29.75,36.95 | v30.75,36.02 30.75,35.95 | v30.75,35.02 30.75,34.95 | v28.32,35.45 28.25,35.45 | v27.75,34.02 27.75,33.95 | v26.75,35.02 26.75,34.95 | v25.75,35.02 25.75,34.95 | v25.75,34.02 25.75,33.9 | v24.75,34.02 24.75,33.95 | v24.75,35.02 24.75,34.95 | v23.75,35.02 23.75,34.95 | v22.75,35.02 22.75,34.95 | v22.75,34.02 22.75,33.95 | v21.75,34.02 21.75,33.95 | v21.32,36.45 21.38,36.45 | v19.75,36.88 19.75,36.85 | v20.32,37.45 20.27,37.45 | v20.75,38.02 20.75,37.95 | v19.75,38.02 19.75,37.95 | v19.75,39.02 19.75,38.95 | v19.75,40.02 19.75,39.98 | v20.75,40.02 20.75,39.9 | v20.75,41.02 20.75,40.95 | v19.75,43.88 19.7,43.8 | v20.32,43.45 20.3,43.4 | v21.32,43.45 21.25,43.45 | v20.75,23.77 20.75,23.73 | v21.75,23.77 21.75,23.73 | v22.75,23.77 22.75,23.73 | v21.75,22.77 21.75,22.73 | v22.75,22.77 22.75,22.73 | v23.75,22.77 23.75,22.73 | v24.75,22.77 24.75,22.73 | v23.75,23.77 23.75,23.73 | v24.75,23.77 24.75,23.73 | v25.75,22.77 25.75,22.73 | v26.75,22.77 26.75,22.73 | v27.75,22.77 27.75,22.73 | v28.75,22.77 28.75,22.73 | v26.75,23.77 26.75,23.68 | v27.75,23.77 27.75,23.73 | v28.75,23.77 28.75,23.73 | v29.75,23.77 29.75,23.73 | v30.75,23.77 30.75,23.73 | v29.75,22.77 29.8,22.77 | v20.75,17.77 20.75,17.73
  Bottom 0.1: v21.75,17.77 21.8,17.77 | v21.75,18.77 21.8,18.73 | v22.75,18.77 22.75,18.73 | v23.75,18.77 23.8,18.73 | v24.75,18.77 24.8,18.73 | v25.75,18.77 25.8,18.73 | v23.75,17.77 23.75,17.73 | v22.75,17.77 22.75,17.73 | v24.75,17.77 24.75,17.73 | v26.75,18.77 26.75,18.82 | v27.75,18.77 27.75,18.73 | v28.75,18.77 28.75,18.73 | v29.75,18.77 29.75,18.68 | v26.75,17.77 26.75,17.73 | v27.75,17.77 27.75,17.73 | v28.75,17.77 28.85,17.88 28.85,17.82 | v29.75,17.77 29.75,17.73 | v30.75,17.77 30.75,17.73 | v20.75,10.12 20.75,10 | v21.75,10.12 21.75,10.05 | v21.75,9.12 21.75,9.05 | v22.75,10.12 22.75,10.05 | v23.75,10.12 23.75,10.05 | v24.75,10.12 24.75,10.05 | v24.75,9.12 24.75,9.05 | v22.75,9.12 22.75,9.05 | v25.75,9.12 25.75,9.05 | v26.75,9.12 26.75,9.05 | v26.75,10.12 26.75,10.05 | v27.75,10.12 27.75,10.05 | v28.75,10.12 28.75,10.05 | v29.75,10.12 29.75,10.05 | v30.75,10.12 30.75,10.05 | v29.75,9.12 29.75,9.05 | v28.75,9.12 28.75,9.05 | v27.75,9.12 27.75,9.05 | v20.75,4.12 20.75,4.05 | v21.75,5.97 21.75,6.05 | v22.75,5.97 22.75,6.05 | v23.75,5.97 23.75,6.1 | v24.75,5.97 24.75,6.1 | v24.75,4.97 24.75,5.05 | v23.75,4.97 23.75,5.05 | v22.75,4.97 22.75,5.05 | v25.75,5.97 25.75,6.05 | v26.75,5.97 26.75,6.05 | v26.75,4.97 26.75,5.05 | v27.75,4.97 27.75,5.05 | v27.75,5.97 27.75,6.05 | v28.75,4.97 28.75,5.1 | v28.75,5.97 28.75,6.05 | v29.75,5.97 29.75,6.15 | v29.75,4.97 29.75,5.05 | v31.18,4.55 31.25,4.55 | v8.22,35.62 v11.95,31.65 | v24.12,57.35 24.05,57.4 | v22.05,57.35 22.05,57.4 | v19.97,57.35 20,57.4 | v16.05,52.65 16.05,52.55
  other vias: 12.25,32.15 11.45,31.65 12.45,31.65 11.45,31.15 11.95,31.15 12.45,31.15 12.1,29.85 12.6,29.85 12.1,29.35 12.6,29.35
  pour Bottom (no thermals): 12.6,43.3 21.6,43.3 21.6,43.6 20.15,43.6 20.15,45.3 22.6,45.3 22.6,44.8 23.5,44.8 23.5,43.65 28.85,43.65 28.85,45 30.65,45 30.65,43.5 30,43.5 30,42.2 29.45,42.2 29.45,36.9 30.55,36.1 30.55,33.95 28.35,33.95 28.35,35.55 27.85,35.55 27.85,35.15 22.5,35.15 22.5,34.55 20,34.55 20,36.35 21.65,36.35 21.65,37.15 23,37.15 23,41.35 14.3,41.35 14.3,41.15 12.7,41.15 12.7,-0.15 40.15,-0.2 40.1,62.25 -0.15,62.15 -0.2,48.55 11.55,48.6 12.6,48.55
  pour Bottom (no thermals): 13.6,32.4 11.25,32.4 11.25,31.65 10,31.65 10,29.9 13.6,29.9
  pour Top (no thermals): 12.85,29.05 12.85,32.5 11.2,32.5 11.2,31.6 10.05,31.6 10.05,30.9 11.2,30.9 11.2,29.05
GND  (via drill 0.15 pad 0.4)
  other vias: 9.8,30.45 10.3,30.45 9.8,29.95 10.3,29.95 9.8,40.6 9.8,40.1 10.3,40.6 10.3,40.1
  pour Top (rank 2, no thermals): 40.05,62.15 -0.05,62.05 -0.1,-0.1 16.95,-0.05 40.05,-0.1
IO25  (via drill 0.15 pad 0.45)
  Top 0.1: JTAGHEADER.1 7.52,58.73 7.52,58.05 12.15,58.05 12.15,53.75 R1.1 14.05,53.25 v14.05,52.65 | MX1.G2@IO25 v15.75,44.88
  Route2 0.1: v15.75,44.88 16.15,44.88 16.15,51.7 14.05,51.7 v14.05,52.65
IO27  (via drill 0.15 pad 0.45)
  Top 0.1: R2.1 5.8,57.35 v5.8,54.25 JTAGHEADER.5 | MX1.H2@IO27 v15.75,43.88
  Route3 0.1: v15.75,43.88 13.35,43.88 13.35,48.23 5.8,48.23 v5.8,54.25 5.8,55.4
IO32  (via drill 0.15 pad 0.4)
  Top 0.1: MX1.K9@IO32 v22.75,41.85 | v28.35,52.65 R13.2
  Route2 0.1: v22.75,41.85 23.15,41.85 23.15,42.85 24.35,42.85 24.35,52.05 28.35,52.05 v28.35,52.65
IO35  (via drill 0.15 pad 0.45)
  Top 0.1: R3.1 5.8,52.7 5.8,49.17 JTAGHEADER.9 v7.52,50.3 | MX1.L4@IO35 v17.32,40.45
  Route2 0.1: v17.32,40.45 17.32,40.85 12.95,40.85 12.95,47.75 7.52,47.73 v7.52,50.3
IO40  (via drill 0.15 pad 0.45)
  Top 0.1: MX1.M5@IO40 v18.32,39.45 | v8.8,56.8 JTAGHEADER.3
  Route2 0.1: v18.32,39.45 18.32,41.05 13.15,41.05 13.15,48.05 8.8,48.05 v8.8,56.8
IO76  (via drill 0.15 pad 0.45)
  Top 0.1: ISSI2(B).A7@CKEB v18.75,8.97 | v15.75,32.02 MX1.W2@IO76
  Route2 0.1: v17.8,8.97 16.15,8.97 16.15,32.02 v15.75,32.02
  Route3 0.1: v18.75,8.97 v17.8,8.97
IO77  (via drill 0.15 pad 0.45)
  Top 0.1: ISSI2(B).B7@WEB v19.75,8.97 | v14.75,30.02 MX1.AA1@IO77
  Route14 0.1: v19.75,8.97 19.15,8.97 19.15,9.55 15.35,9.55 15.35,30.02 v14.75,30.02
IO78  (via drill 0.15 pad 0.45)
  Top 0.1: ISSI2(B).E2@DQC4 v22.75,3.98 | ISSI1(A).E2@DQC4 v22.75,16.77 | v23.75,30.02 MX1.AA10@IO78
  Route15 0.1: v22.75,3.98 23.15,4 23.15,16.77 | 23.15,16.77 23.15,30.02 v23.75,30.02 | v22.75,16.77 23.15,16.77
IO79  (via drill 0.15 pad 0.45)
  Top 0.1: ISSI1(A).A3@CEB v18.75,18.62 | v15.75,30.02 MX1.AA2@IO79
  Route3 0.1: v18.75,18.62 16.15,18.62 16.15,30.02 v15.75,30.02
IO80  (via drill 0.15 pad 0.45)
  Top 0.1: ISSI1(A).A10@A11 v18.75,25.62 | v16.75,30.02 MX1.AA3@IO80
  Route3 0.1: v18.75,25.62 17.15,25.62 17.15,30.02 v16.75,30.02
IO81  (via drill 0.15 pad 0.45)
  Top 0.1: ISSI1(A).B2@A6 v19.75,17.62 | v18.75,30.05 MX1.AA5@IO81
  Route14 0.1: v19.75,17.62 19.15,17.62 19.15,30.05 v18.75,30.05
IO82  (via drill 0.15 pad 0.45)
  Top 0.1: ISSI1(A).B8@OEB v19.75,23.62 | v19.75,30.02 MX1.AA6@IO82
  Route14 0.1: v19.75,23.62 19.35,23.62 19.35,30.02 v19.75,30.02
IO83  (via drill 0.15 pad 0.45)
  Top 0.1: ISSI2(B).B10@A10 v19.75,11.97 | v20.75,30.02 MX1.AA7@IO83
  Route3 0.1: v19.75,11.97 20.35,12 20.35,30.02 v20.75,30.02
IO84  (via drill 0.15 pad 0.45)
  Top 0.1: ISSI2(B).B2@A6 v19.75,3.12 | v21.75,30.02 MX1.AA8@IO84
  Route3 0.1: v19.75,3.12 20.35,3.1 20.35,4.95 21.15,4.95 21.15,30.02 v21.75,30.02
IO85  (via drill 0.15 pad 0.45)
  Top 0.1: v21.75,3.98 ISSI2(B).D2@DQC3 | ISSI1(A).D2@DQC3 v21.75,16.77 | v22.75,30.02 MX1.AA9@IO85
  Route15 0.1: v22.75,30.02 22.15,30.02 22.15,16.77 | 22.15,16.77 22.15,4 v21.75,3.98 | v21.75,16.77 22.15,16.77
IO86  (via drill 0.15 pad 0.45)
  Top 0.1: ISSI1(A).A2@A7 v18.75,16.77 | v15.75,29.02 MX1.AB2@IO86
  Route3 0.1: v18.75,16.77 15.75,16.77 v15.75,29.02
IO87  (via drill 0.15 pad 0.45)
  Top 0.1: ISSI1(A).A7@CKEB v18.75,22.62 | v16.75,29.02 MX1.AB3@IO87
  Route3 0.1: v18.75,22.62 16.75,22.62 v16.75,29.02
IO88  (via drill 0.15 pad 0.45)
  Top 0.1: ISSI2(B).B8@OEB v19.75,9.97 | MX1.AB4@IO88 v17.75,29.02
  Route14 0.1: v19.75,9.97 19.35,10 19.35,10.6 18.15,10.6 18.15,29.02 v17.75,29.02
IO89  (via drill 0.15 pad 0.45)
  Top 0.1: ISSI1(A).A6@CE2B v18.75,21.62 | v18.75,29.02 MX1.AB5@IO89
  Route15 0.1: v18.75,21.62 19.15,21.62 19.15,29.02 v18.75,29.02
IO90  (via drill 0.15 pad 0.45)
  Top 0.1: ISSI1(A).B7@WEB v19.75,22.62 | v19.75,29.02 MX1.AB6@IO90
  Route15 0.1: v19.75,22.62 19.35,22.62 19.35,29.02 v19.75,29.02
IO91  (via drill 0.15 pad 0.45)
  Top 0.1: ISSI2(B).A10@A11 v18.75,11.97 | v20.75,29.02 MX1.AB7@IO91
  Route2 0.1: v18.75,11.97 19.35,12 19.35,12.95 20.15,12.95 20.15,29.02 v20.75,29.02
IO92  (via drill 0.15 pad 0.45)
  Top 0.1: v20.75,2.98 ISSI2(B).C1@DQC0 | v20.75,15.78 ISSI1(A).C1@DQC0 | v21.75,29.02 MX1.AB8@IO92
  Route14 0.1: v21.75,29.02 21.35,29.02 21.35,15.78 | 21.35,15.78 21.35,3 v20.75,2.98 | 21.35,15.78 v20.75,15.78
IO93  (via drill 0.15 pad 0.45)
  Top 0.1: v21.75,2.98 ISSI2(B).D1@DQC1 | ISSI1(A).D1@DQC1 v21.75,15.78 | v22.75,29.02 MX1.AB9@IO93
  Route14 0.1: v22.75,29.02 22.35,29.02 22.35,15.78 | 22.35,15.78 22.35,3 v21.75,2.98 | v21.75,15.78 22.35,15.78
IO107  (via drill 0.15 pad 0.45)
  Top 0.1: v21.75,13 ISSI2(B).D11@DQB4 | ISSI1(A).D11@DQB4 v21.75,25.77 | v22.75,33.02 MX1.V9@IO107
  Route2 0.1: v22.75,33.02 22.15,33.02 22.15,25.77 | 22.15,25.77 22.15,13 v21.75,13 | v21.75,25.77 22.15,25.77
IO108  (via drill 0.15 pad 0.45)
  Top 0.1: v22.75,13 ISSI2(B).E11@DQB5 | ISSI1(A).E11@DQB5 v22.75,25.77 | v23.75,32.02 MX1.W10@IO108
  Route2 0.1: v23.75,32.02 23.15,32.02 23.15,25.77 | 23.15,25.77 23.15,13 v22.75,13 | v22.75,25.77 23.15,25.77
IO109  (via drill 0.15 pad 0.45)
  Top 0.1: ISSI1(A).A8@ADV v18.75,23.62 | v16.75,32.02 MX1.W3@IO109
  Route3 0.1: v18.75,23.62 v17.35,23.62
  Route14 0.1: v17.35,23.62 17.35,32.02 v16.75,32.02
IO110  (via drill 0.15 pad 0.45)
  Top 0.1: ISSI2(B).A6@CE2B v18.75,7.97 | v17.75,32.02 MX1.W4@IO110
  Route15 0.1: v18.75,7.97 18.15,8 18.15,32.02 v17.75,32.02
IO111  (via drill 0.15 pad 0.45)
  Top 0.1: ISSI1(A).B6@CLK v19.75,21.62 | v18.75,32.02 MX1.W5@IO111 | ISSI2(B).B6@CLK v19.32,7.55
  Route2 0.1: v19.75,21.62 19.35,21.62 | 19.35,21.62 19.15,21.62 19.15,32.02 v18.75,32.02 | v19.35,16.77 19.35,21.62
  Route3 0.1: v19.32,7.55 19.35,7.7 v19.35,16.77 | 19.35,21.62 v19.75,21.62
IO112  (via drill 0.15 pad 0.45)
  Top 0.1: ISSI1(A).B10@A10 v19.75,25.62 | v19.75,32.02 MX1.W6@IO112
  Route2 0.1: v19.75,25.62 19.35,25.62 19.35,32.02 v19.75,32.02
IO113  (via drill 0.15 pad 0.45)
  Top 0.1: ISSI2(B).B9@A8 v19.75,10.97 | v20.75,32.02 MX1.W7@IO113
  Route14 0.1: v19.75,10.97 20.35,10.97 20.35,32.02 v20.75,32.02
IO114  (via drill 0.15 pad 0.45)
  Top 0.1: v20.75,13 ISSI2(B).C11@DQB0 | ISSI1(A).C11@DQB0 v20.75,25.77 | v21.75,32.02 MX1.W8@IO114
  Route2 0.1: v21.75,32.02 21.15,32.02 21.15,25.77 | 21.15,25.77 21.15,13 v20.75,13 | v20.75,25.77 21.15,25.77
IO115  (via drill 0.15 pad 0.45)
  Top 0.1: v21.75,11.97 ISSI2(B).D10@DQB1 | ISSI1(A).D10@DQB1 v21.75,24.77 | v22.75,32.02 MX1.W9@IO115
  Route3 0.1: v22.75,32.02 22.35,32.02 22.35,24.77 | 22.35,24.77 22.35,11.97 v21.75,11.97 | v21.75,24.77 22.35,24.77
IO117  (via drill 0.15 pad 0.45)
  Top 0.1: v22.75,11.97 ISSI2(B).E10@DQB2 | ISSI1(A).E10@DQB2 v22.75,24.77 | v23.75,31.02 MX1.Y10@IO117
  Route3 0.1: v23.75,31.02 23.35,31.02 23.35,24.77 | 23.35,24.77 23.35,11.97 v22.75,11.97 | v22.75,24.77 23.35,24.77
IO118  (via drill 0.15 pad 0.45)
  Top 0.1: ISSI2(B).A8@ADV v18.75,9.97 | v15.75,31.02 MX1.Y2@IO118
  Route14 0.1: v18.75,9.97 v17.77,9.97
  Route15 0.1: v17.77,9.97 16.15,9.97 16.15,31.02 v15.75,31.02
IO119  (via drill 0.15 pad 0.45)
  Top 0.1: ISSI1(A).A9@A9 v18.75,24.62 | v16.75,31.02 MX1.Y3@IO119
  Route3 0.1: v18.75,24.62 v17.7,24.62
  Route15 0.1: v17.7,24.62 17.15,24.62 17.15,31.02 v16.75,31.02
IO120  (via drill 0.15 pad 0.45)
  Top 0.1: ISSI2(B).B3@CE2 v19.32,4.55 | v17.75,31.02 MX1.Y4@IO120
  Route2 0.1: v19.32,4.55 19.3,5.15 18.15,5.15 18.15,31.02 v17.75,31.02
IO121  (via drill 0.15 pad 0.45)
  Top 0.1: ISSI1(A).B3@CE2 v19.75,18.62 | v18.75,31.02 MX1.Y5@IO121
  Route3 0.1: v19.75,18.62 19.15,18.62 19.15,31.02 v18.75,31.02
IO122  (via drill 0.15 pad 0.45)
  Top 0.1: ISSI1(A).B9@A8 v19.75,24.62 | v19.75,31.02 MX1.Y6@IO122
  Route3 0.1: v19.75,24.62 19.75,24.7 19.35,24.7 19.35,31.02 v19.75,31.02
IO123  (via drill 0.15 pad 0.45)
  Top 0.1: ISSI2(B).A9@A9 v18.75,10.97 | v20.75,31.02 MX1.Y7@IO123
  Route15 0.1: v18.75,10.97 19.35,10.97 19.35,12.95 20.15,12.95 20.15,31.02 v20.75,31.02
IO124  (via drill 0.15 pad 0.45)
  Top 0.1: ISSI2(B).A2@A7 v18.75,3.98 | v21.75,31.02 MX1.Y8@IO124
  Route15 0.1: v18.75,3.98 20.15,4 20.15,4.95 21.15,4.95 21.15,31.02 v21.75,31.02
IO125  (via drill 0.15 pad 0.45)
  Top 0.1: v23.75,3.98 ISSI2(B).F2@DQC7 | ISSI1(A).F2@DQC7 v23.75,16.77 | v24.75,30.02 MX1.AA11@IO125
  Route15 0.1: v24.75,30.02 24.15,30.02 24.15,16.77 | 24.15,16.77 24.15,4 v23.75,3.98 | v23.75,16.77 24.15,16.77
IO126  (via drill 0.15 pad 0.45)
  Top 0.1: ISSI2(B).G2@DQC8 v24.75,3.98 | v24.75,16.77 ISSI1(A).G2@DQC8 | v25.75,30.02 MX1.AA12@IO126
  Route15 0.1: v25.75,30.02 25.15,30.02 25.15,16.77 | v24.75,3.98 24.75,3.95 25.15,3.95 25.15,16.77 | 25.15,16.77 v24.75,16.77
IO127  (via drill 0.15 pad 0.45)
  Top 0.1: MX1.AA13@IO127 v26.75,30.02 | v26.75,3.98 ISSI2(B).J2@DQD6 | ISSI1(A).J2@DQD6 v26.75,16.77
  Route15 0.1: v26.75,30.02 26.15,30.02 26.15,16.77 | 26.15,16.77 26.15,4 v26.75,3.98 | v26.75,16.77 26.15,16.77
IO128  (via drill 0.15 pad 0.45)
  Top 0.1: MX1.AA14@IO128 v27.75,30.02 | v27.75,3.98 ISSI2(B).K2@DQD3 | ISSI1(A).K2@DQD3 v27.75,16.77
  Route15 0.1: v27.75,30.02 27.15,30.02 27.15,16.77 | 27.15,16.77 27.15,4 v27.75,3.98 | v27.75,16.77 27.15,16.77
IO129  (via drill 0.15 pad 0.45)
  Top 0.1: MX1.AA15@IO129 v28.75,30.02 | v28.75,3.98 ISSI2(B).L2@DQD2 | ISSI1(A).L2@DQD2 v28.75,16.77
  Route15 0.1: v28.75,30.02 28.15,30.02 28.15,16.77 | 28.15,16.77 28.15,4 v28.75,3.98 | v28.75,16.77 28.15,16.77
IO130  (via drill 0.15 pad 0.45)
  Top 0.1: MX1.AA16@IO130 v29.75,30.02 | v29.75,16.77 ISSI1(A).M2@DQD1 | ISSI2(B).M2@DQD1 v29.75,3.98
  Route15 0.1: v29.75,30.02 29.15,30.02 29.15,16.77 | 29.15,16.77 v29.75,16.77 | v29.75,3.98 29.15,4 29.15,16.77
IO131  (via drill 0.15 pad 0.45)
  Top 0.1: ISSI2(B).P3@A5 v31.75,4.97 | v30.75,30.02 MX1.AA17@IO131
  Route3 0.1: v31.75,4.97 30.15,5 30.15,30.02 v30.75,30.02
IO132  (via drill 0.15 pad 0.45)
  Top 0.1: ISSI2(B).R10@A13 v32.75,11.97 | v32.75,30.02 MX1.AA19@IO132
  Route3 0.1: v32.75,11.97 33.15,11.97 33.15,30.02 v32.75,30.02
IO133  (via drill 0.15 pad 0.45)
  Top 0.1: ISSI2(B).R9@A16 v32.75,10.97 | v33.75,30.02 MX1.AA20@IO133
  Route2 0.1: v32.75,10.97 33.35,11 33.35,30.02 v33.75,30.02
IO134  (via drill 0.15 pad 0.45)
  Top 0.1: v22.75,2.98 ISSI2(B).E1@DQC2 | ISSI1(A).E1@DQC2 v22.75,15.78 | v23.75,29.02 MX1.AB10@IO134
  Route14 0.1: v23.75,29.02 23.35,29.02 23.35,15.78 | 23.35,15.78 23.35,3 v22.75,2.98 | v22.75,15.78 23.35,15.78
IO135  (via drill 0.15 pad 0.45)
  Top 0.1: v23.75,2.98 ISSI2(B).F1@DQC5 | ISSI1(A).F1@DQC5 v23.75,15.78 | v24.75,29.02 MX1.AB11@IO135
  Route14 0.1: v24.75,29.02 24.35,29.02 24.35,15.78 | 24.35,15.78 24.35,3 v23.75,2.98 | v23.75,15.78 24.35,15.78
IO136  (via drill 0.15 pad 0.45)
  Top 0.1: ISSI2(B).G1@DQC6 v24.75,2.98 | v24.75,15.78 ISSI1(A).G1@DQC6 | v25.75,29.02 MX1.AB12@IO136
  Route14 0.1: v25.75,29.02 25.35,29.02 25.35,15.78 | v24.75,2.98 24.75,2.95 25.35,2.95 25.35,15.78 | 25.35,15.78 v24.75,15.78
IO137  (via drill 0.15 pad 0.45)
  Top 0.1: MX1.AB13@IO137 v26.75,29.02 | v26.75,2.92 ISSI2(B).J1@DQD8 | ISSI1(A).J1@DQD8 v26.75,15.78
  Route14 0.1: v26.75,29.02 26.35,29.02 26.35,15.78 | 26.35,15.78 26.35,2.95 v26.75,2.92 | v26.75,15.78 26.35,15.78
IO138  (via drill 0.15 pad 0.45)
  Top 0.1: MX1.AB14@IO138 v27.75,29.02 | v27.75,15.78 ISSI1(A).K1@DQD7 | ISSI2(B).K1@DQD7 v27.75,2.98
  Route14 0.1: v27.75,29.02 27.35,29.02 27.35,15.78 | 27.35,15.78 v27.75,15.78 | v27.75,2.98 27.35,3 27.35,15.78
IO139  (via drill 0.15 pad 0.45)
  Top 0.1: MX1.AB15@IO139 v28.75,29.02 | v28.75,2.98 ISSI2(B).L1@DQD5 | ISSI1(A).L1@DQD5 v28.75,15.78
  Route14 0.1: v28.75,29.02 28.35,29.02 28.35,15.78 | 28.35,15.78 28.35,3 v28.75,2.98 | v28.75,15.78 28.35,15.78
IO140  (via drill 0.15 pad 0.45)
  Top 0.1: ISSI1(A).M1@DQD4 v29.75,15.78 | v29.75,29.02 MX1.AB16@IO140 | ISSI2(B).M1@DQD4 v29.75,2.98
  Route14 0.1: v29.75,15.78 29.35,15.78 | 29.35,15.78 29.35,29.02 v29.75,29.02 | v29.75,2.98 29.35,3 29.35,15.78
IO141  (via drill 0.15 pad 0.45)
  Top 0.1: MX1.AB17@IO141 v30.75,29.02 | v30.75,15.78 ISSI1(A).N1@DQD0 | ISSI2(B).N1@DQD0 v30.75,2.98
  Route14 0.1: v30.75,29.02 30.35,29.02 30.35,15.78 | 30.35,15.78 v30.75,15.78 | v30.75,2.98 30.35,3 30.35,15.78
IO142  (via drill 0.15 pad 0.45)
  Top 0.1: ISSI2(B).R4@A3 v32.75,5.97 | v31.75,29.02 MX1.AB18@IO142
  Route14 0.1: v32.75,5.97 32.15,6 32.15,7.15 31.35,7.15 31.35,29.02 v31.75,29.02
IO143  (via drill 0.15 pad 0.45)
  Top 0.1: ISSI2(B).R11@A12 v32.75,13 | v32.75,29.02 MX1.AB19@IO143
  Route2 0.1: v32.75,13 33.15,13 33.15,29.02 v32.75,29.02
IO144  (via drill 0.15 pad 0.45)
  Top 0.1: ISSI2(B).R8@A17 v32.75,9.97 | v33.75,29.02 MX1.AB20@IO144
  Route3 0.1: v32.75,9.97 33.35,10 33.35,29.02 v33.75,29.02
IO145  (via drill 0.15 pad 0.45)
  Top 0.1: MX1.AB21@IO145 v34.75,29.07 | ISSI1(A).P10@A14 v31.75,25.62
  Route14 0.1: v34.75,29.07 34.35,29.07 34.35,27.2 32.15,27.2 32.15,25.62 v31.75,25.62
IO152  (via drill 0.15 pad 0.45)
  Top 0.1: ISSI1(A).G11@DQB8 v24.75,25.77 | ISSI2(B).G11@DQB8 v24.75,13 | v25.75,33.02 MX1.V12@IO152
  Route2 0.1: v25.75,33.02 25.15,33.02 25.15,25.77 | v24.75,25.77 25.15,25.77 | v24.75,13 25.15,13 25.15,25.77
IO153  (via drill 0.15 pad 0.45)
  Top 0.1: MX1.V13@IO153 v26.75,33.02 | v26.75,13 ISSI2(B).J11@DQA6 | ISSI1(A).J11@DQA6 v26.75,25.77
  Route2 0.1: v26.75,33.02 26.15,33.02 26.15,25.77 | 26.15,25.77 26.15,13 v26.75,13 | v26.75,25.77 26.15,25.77
IO154  (via drill 0.15 pad 0.45)
  Top 0.1: MX1.V14@IO154 v27.75,33.02 | v27.75,13 ISSI2(B).K11@DQA5 | ISSI1(A).K11@DQA5 v27.75,25.77
  Route2 0.1: v27.75,33.02 27.15,33.02 27.15,25.77 | 27.15,25.77 27.15,13 v27.75,13 | v27.75,25.77 27.15,25.77
IO155  (via drill 0.15 pad 0.45)
  Top 0.1: MX1.V15@IO155 v28.75,33.02 | v28.75,13 ISSI2(B).L11@DQA2 | ISSI1(A).L11@DQA2 v28.75,25.77
  Route2 0.1: v28.75,33.02 28.15,33.02 28.15,25.77 | 28.15,25.77 28.15,13 v28.75,13 | v28.75,25.77 28.15,25.77
IO156  (via drill 0.15 pad 0.45)
  Top 0.1: MX1.V16@IO156 v29.75,33.02 | v29.75,13 ISSI2(B).M11@DQA1 | ISSI1(A).M11@DQA1 v29.75,25.77
  Route2 0.1: v29.75,33.02 29.15,33.02 29.15,25.77 | 29.15,25.77 29.15,13 v29.75,13 | v29.75,25.77 29.15,25.77
IO157  (via drill 0.15 pad 0.45)
  Top 0.1: MX1.V17@IO157 v30.75,33.02 | v30.75,13 ISSI2(B).N11@DQA0 | ISSI1(A).N11@DQA0 v30.75,25.77
  Route2 0.1: v30.75,33.02 30.15,33.02 30.15,25.77 | 30.15,25.77 30.15,13 v30.75,13 | v30.75,25.77 30.15,25.77
IO158  (via drill 0.15 pad 0.45)
  Top 0.1: v23.75,13 ISSI2(B).F11@DQB7 | ISSI1(A).F11@DQB7 v23.75,25.77 | v24.75,32.02 MX1.W11@IO158
  Route2 0.1: v24.75,32.02 24.15,32.02 24.15,25.77 | 24.15,25.77 24.15,13 v23.75,13 | v23.75,25.77 24.15,25.77
IO159  (via drill 0.15 pad 0.45)
  Top 0.1: ISSI1(A).G10@DQB6 v24.75,24.77 | ISSI2(B).G10@DQB6 v24.75,11.97 | v25.75,32.02 MX1.W12@IO159
  Route3 0.1: v25.75,32.02 25.35,32.02 25.35,24.77 | v24.75,24.77 25.35,24.77 | v24.75,11.97 25.35,11.97 25.35,24.77
IO160  (via drill 0.15 pad 0.45)
  Top 0.1: MX1.W13@IO160 v26.75,32.02 | v26.75,11.97 ISSI2(B).J10@DQA8 | ISSI1(A).J10@DQA8 v26.75,24.77
  Route3 0.1: v26.75,32.02 26.35,32.02 26.35,24.77 | 26.35,24.77 26.35,11.97 v26.75,11.97 | v26.75,24.77 26.35,24.77
IO161  (via drill 0.15 pad 0.45)
  Top 0.1: MX1.W14@IO161 v27.75,32.02 | v27.75,11.97 ISSI2(B).K10@DQA7 | ISSI1(A).K10@DQA7 v27.75,24.77
  Route3 0.1: v27.75,32.02 27.35,32.02 27.35,24.77 | 27.35,24.77 27.35,11.97 v27.75,11.97 | v27.75,24.77 27.35,24.77
IO162  (via drill 0.15 pad 0.45)
  Top 0.1: MX1.W15@IO162 v28.75,32.02 | v28.75,11.97 ISSI2(B).L10@DQA4 | ISSI1(A).L10@DQA4 v28.75,24.77
  Route3 0.1: v28.75,32.02 28.35,32.02 28.35,24.77 | 28.35,24.77 28.35,11.97 v28.75,11.97 | v28.75,24.77 28.35,24.77
IO163  (via drill 0.15 pad 0.45)
  Top 0.1: MX1.W16@IO163 v29.75,32.02 | v29.75,11.97 ISSI2(B).M10@DQA3 | ISSI1(A).M10@DQA3 29.85,25.18 29.75,25.02 v29.75,24.77
  Route3 0.1: v29.75,32.02 29.35,32.02 29.35,24.77 | 29.35,24.77 29.35,11.97 v29.75,11.97 | v29.75,24.77 29.35,24.77
IO164  (via drill 0.15 pad 0.45)
  Top 0.1: ISSI2(B).R3@A4 v32.75,4.12 | v30.75,32.02 MX1.W17@IO164
  Route15 0.1: v32.75,4.12 30.15,4.1 30.15,32.02 v30.75,32.02
IO165  (via drill 0.15 pad 0.45)
  Top 0.1: ISSI2(B).R6@A0 v32.75,7.97 | v31.75,32.02 MX1.W18@IO165
  Route3 0.1: v32.75,7.97 32.15,8 32.15,9.15 31.35,9.15 31.35,32.02 v31.75,32.02
IO166  (via drill 0.15 pad 0.45)
  Top 0.1: v23.75,11.97 ISSI2(B).F10@DQB3 | ISSI1(A).F10@DQB3 v23.75,24.77 | v24.75,31.02 MX1.Y11@IO166
  Route3 0.1: v24.75,31.02 24.35,31.02 24.35,24.77 | 24.35,24.77 24.35,11.97 v23.75,11.97 | v23.75,24.77 24.35,24.77
IO170  (via drill 0.15 pad 0.45)
  Top 0.1: ISSI2(B).P4@A2 v31.75,5.97 | v30.75,31.02 MX1.Y17@IO170
  Route15 0.1: v31.75,5.97 30.35,6 30.35,31.02 v30.75,31.02
IO171  (via drill 0.15 pad 0.45)
  Top 0.1: ISSI2(B).P6@A1 v31.75,7.97 | v31.75,31.02 MX1.Y18@IO171
  Route15 0.1: v31.75,7.97 31.15,8 31.15,31.02 v31.75,31.02
IO172  (via drill 0.15 pad 0.45)
  Top 0.1: ISSI2(B).P9@A15 v31.75,10.97 | v32.75,31.02 MX1.Y19@IO172
  Route3 0.1: v31.75,10.97 32.35,11 32.35,31.02 v32.75,31.02
IO173  (via drill 0.15 pad 0.45)
  Top 0.1: ISSI1(A).R11@A12 v32.75,26.65 | v34.75,30.02 MX1.AA21@IO173
  Route15 0.1: v32.75,26.65 34.15,26.65 34.15,30.02 v34.75,30.02
IO174  (via drill 0.15 pad 0.45)
  Top 0.1: ISSI1(A).P6@A1 v31.75,21.62 | v35.75,30.02 MX1.AA22@IO174
  Route14 0.1: v31.75,21.62 35.35,21.62 35.35,30.02 v35.75,30.02
IO201  (via drill 0.15 pad 0.45)
  Top 0.1: ISSI1(A).P3@A5 v31.75,18.62 | v34.35,34.45 MX1.U21@IO201
  Route2 0.1: v33.9,18.5 36.35,18.5 36.35,34 34.35,34 v34.35,34.45
  Route14 0.1: v31.75,18.62 32.15,18.62 32.15,18.5 v33.9,18.5
IO202  (via drill 0.15 pad 0.45)
  Top 0.1: ISSI1(A).R3@A4 v32.75,17.77 | v35.33,34.45 MX1.U22@IO202
  Route3 0.1: v33.88,17.77 36.35,17.77 36.35,34 35.33,34 v35.33,34.45
  Route15 0.1: v32.75,17.77 v33.88,17.77
IO203  (via drill 0.15 pad 0.45)
  Top 0.1: ISSI2(B).P8@A18 v31.75,9.97 | v31.75,33.02 MX1.V18@IO203
  Route2 0.1: v31.75,9.97 31.15,10 31.15,33.02 v31.75,33.02
IO204  (via drill 0.15 pad 0.45)
  Top 0.1: ISSI1(A).P8@A18 v31.75,23.62 | v33.75,33.02 MX1.V20@IO204
  Route14 0.1: v31.75,23.62 31.95,23.6 v33.9,23.6
  Route15 0.1: v33.9,23.6 35.15,23.6 35.15,32.23 34.15,32.23 34.15,33.02 v33.75,33.02
IO205  (via drill 0.15 pad 0.45)
  Top 0.1: ISSI1(A).R8@A17 v32.75,22.77 | v34.75,33.02 MX1.V21@IO205
  Route15 0.1: v32.75,22.77 35.35,22.77 35.35,33.02 v34.75,33.02
IO206  (via drill 0.15 pad 0.45)
  Top 0.1: ISSI1(A).P4@A2 v31.75,19.62 | v35.75,33.02 MX1.V22@IO206
  Route14 0.1: v31.75,19.62 32.15,19.62 32.15,18.85 36.35,18.85 36.35,33.02 v35.75,33.02
IO207  (via drill 0.15 pad 0.45)
  Top 0.1: ISSI2(B).P10@A14 v31.75,11.97 | v32.75,32.02 MX1.W19@IO207
  Route2 0.1: v31.75,11.97 32.15,11.97 32.15,32.02 v32.75,32.02
IO208  (via drill 0.15 pad 0.45)
  Top 0.1: ISSI1(A).R9@A16 v32.75,24.62 | v33.75,32.02 MX1.W20@IO208
  Route2 0.1: v33.9,24.62 34.35,24.62 34.35,32.02 v33.75,32.02
  Route15 0.1: v32.75,24.62 v33.9,24.62
IO209  (via drill 0.15 pad 0.45)
  Top 0.1: ISSI1(A).R4@A3 v32.75,19.62 | v35.75,32.02 MX1.W22@IO209
  Route14 0.1: v33.9,19.62 36.15,19.62 36.15,32.02 v35.75,32.02
  Route15 0.1: v32.75,19.62 v33.9,19.62
IO210  (via drill 0.15 pad 0.45)
  Top 0.1: ISSI1(A).R10@A13 v32.75,25.62 | v33.75,31.02 MX1.Y20@IO210
  Route2 0.1: v33.9,25.62 34.15,25.62 34.15,31.02 v33.75,31.02
  Route15 0.1: v32.75,25.62 v33.9,25.62
IO211  (via drill 0.15 pad 0.45)
  Top 0.1: ISSI1(A).P9@A15 v31.75,24.62 | v34.75,31.02 MX1.Y21@IO211
  Route14 0.1: v31.75,24.62 32.35,24.62 32.35,24.25 35.15,24.25 35.15,31.02 v34.75,31.02
IO212  (via drill 0.15 pad 0.45)
  Top 0.1: ISSI1(A).R6@A0 v32.75,20.77 | v35.75,31.02 MX1.Y22@IO212
  Route15 0.1: v32.75,20.77 36.15,20.77 36.15,31.02 v35.75,31.02
IO213
  Top 0.1: MX1.A21@IO213 34.75,53.5 R11.2
IO215
  Top 0.1: MX1.B21@IO215 35.25,49.45 35.25,51.85 36.6,51.85 R12.2
IO216
  Top 0.1: SW.9-.2 38.7,49.45 MX1.B22@IO216
IO219
  Top 0.1: MX1.C22@IO219 37.35,48.45 37.35,41.65 SW.14+.2
IO223
  Top 0.1: SW.15-.2 37.15,33.4 37.15,47.45 MX1.D22@IO223
IO229
  Top 0.1: SW.16+.2 36.95,25.25 36.95,46.45 MX1.E22@IO229
IO281
  Top 0.1: MX1.A18@IO281 31.75,51.8 30.45,51.8 R7.2
IO283
  Top 0.1: MX1.A20@IO283 33.75,51.85 32.45,51.85 32.45,53 R8.2
IO348  (via drill 0.15 pad 0.4)
  Top 0.1: SW.10-.1 16.2,55.65 R10.2 15.85,54.7 17.9,54.7 C6.1 18,53.25 v18,52.65 | MX1.D9@IO348 v22.75,47.85
  Route14 0.1: v22.75,47.85 22.35,47.85 22.35,52.05 18,52.05 v18,52.65
IO355  (via drill 0.15 pad 0.45)
  Top 0.1: MX1.F8@IO355 v21.75,45.88 | v22.15,52.65 22.15,53.15 R5.2
  Route2 0.1: v21.75,45.88 22.15,45.88 v22.15,52.65
IO356  (via drill 0.15 pad 0.4)
  Top 0.1: MX1.G9@IO356 v22.35,44.45 | R4.2 19.95,53.2 v19.95,52.65
  Route2 0.1: v22.35,44.45 22.35,44.85 21.15,44.85 21.15,51.85 19.95,51.85 v19.95,52.65
IO359  (via drill 0.15 pad 0.45)
  Top 0.1: MX1.H9@IO359 v22.75,43.88 | v24.15,52.65 R6.2 24.15,54.7 26.25,54.7 C5.1 26.25,58.45 26.2,58.45 SW.6-.1
  Route2 0.1: v22.75,43.88 23.15,43.88 23.15,44.85 24.15,44.85 v24.15,52.65
N$1
  Top 0.1: R7.1 LED1.A
N$2  (1 unrouted)
  Top 0.2: 8.25,39.65 8.7,40.77 ENPI1V2.3@GND | 8.1,29.85 ENPI2V5.3@GND
  Top 1: 8.25,39.65 8.2,38.7 8.2,37.52 INPOW.2 | INPOW2.2 8.1,27.38 8.1,29.85
  pour Top (isolate 0.15, no thermals): 8.85,39.15 8.85,42.1 8.55,42.1 8.55,41.05 7.5,41.05 7.5,39.15
  pour Top (no thermals): 9.1,31.5 8.75,31.5 8.75,30.7 7.45,30.7 7.45,29.1 9.1,29.1
N$3
  Top 0.1: R11.1 LED3.A
N$4
  Top 0.1: R8.1 LED2.A
N$5
  Top 0.1: SW.9-.1 R9.2
N$6
  Top 0.1: R12.1 36.65,56 36.65,57.85 36.6,57.5 36.75,57.75 LED4.A
N$7
  Top 0.1: R14.2 SW.14+.1
N$8
  Top 0.1: ISSI2(B).B5@BWAB 19.75,6.95 17.75,6.95 17.75,7.25 R17.2
N$9
  Top 0.1: R16.2 SW.16+.1
N$10
  Top 0.1: SW.15-.1 R15.2
N$11
  Top 0.1: ISSI1(A).B5@BWAB 19.75,20.6 17.75,20.6 17.75,20.8 R21.2
N$12
  Top 0.1: ISSI2(B).A5@BWBB 17.75,6.55 17.75,5.2 R18.2
N$13
  Top 0.1: ISSI2(B).A4@BWCB 17.95,5.55 17.95,3.15 R19.2
N$14
  Top 0.1: ISSI1(A).A5@BWBB 17.75,20.2 17.75,18.75 R22.2
N$15
  Top 0.1: ISSI1(A).B4@BWDB 19.25,19.2 19.25,17.75 18.35,17.75 18.35,14.65 R24.2
N$16
  Top 0.1: ISSI2(B).B4@BWDB 19.75,5.15 18.15,5.15 18.15,1.1 R20.2
N$17
  Top 0.1: ISSI1(A).A4@BWCB 17.95,19.2 17.95,16.7 R23.2
VIN  (1 unrouted)
  Top 0.2: ENPI1V2.2@VIN ENPI1V2.1@VIN 6.03,41.85 | 6.03,41.85 6.03,40.52 6.25,40.3 | ENPI1V2.17@VS2 6.03,44.73 6.03,43.42 | 6.03,43.42 6.03,42.77 | 6.03,42.77 6.03,41.85 | ENPI1V2.20@ENABLE 6.03,42.77 | ENPI1V2.19@VS0 6.03,43.42 | ENPI2V5.19@VS0 6,32.83 6,32.17 | 6,32.17 6,31.25 | 6,31.25 6,29.93 | ENPI2V5.20@ENABLE 6,32.17 | 6,31.25 ENPI2V5.1@VIN ENPI2V5.2@VIN
  Top 1: 6.25,40.3 C1.1 5.08,40.08 INPOW.1 | INPOW2.1 6,29.93 C4.1
  pour Top (no thermals): 8.25,42.1 5.65,42.1 5.65,39.15 7.1,39.15 7.1,41.3 8.25,41.3
  pour Top (no thermals): 8.4,31.5 5.6,31.5 5.6,29.05 7.15,29.05 7.15,30.95 8.4,30.95

## Text on the board
tPlace: gcl-1-b
tNames: DEV_CLRn | nCONFIG | CONF.DONE | 1.TCK | 2.GND | nSTATUS | 3.TDO | 4.VCC | 5.TMS | 6.NC | 7.NC | 8.NC | 1uF | 9.TDI | 10.GND | 5V | 4.7uF | 10uF | GND | 5V | 4.7uF | 10uF | GND | 1V2 | 2V5 | 0,0